# Altium project copper_suicide.PrjPCB (part 3 of 5)

## Sheet fpga-power.SchDoc: CS - FPGA - Power
size Letter; CheckedBy: J. Brinton; CompanyName: Signal Laboratories, Inc.; DrawnBy: J. Brinton; Engineer: J. Brinton; Address1: 3479 Edison Way; Address2: Menlo Park CA 94025; Address3: +1 (877) 778-8435; Address4: siglabs.com; Revision: 3; SheetNumber: 13; SheetTotal: 47
Used 17 times, as channels FPGA01/FPGAPOWER, FPGA02/FPGAPOWER, FPGA03/FPGAPOWER, FPGA30/FPGAPOWER, FPGA31/FPGAPOWER, FPGA32/FPGAPOWER, FPGA33/FPGAPOWER, FPGA10/FPGAPOWER, FPGA11/FPGAPOWER, FPGA12/FPGAPOWER, FPGA13/FPGAPOWER, FPGA20/FPGAPOWER, FPGA21/FPGAPOWER, FPGA22/FPGAPOWER, FPGA23/FPGAPOWER, CFG/FPGAPOWER, FPGA00/FPGAPOWER. Parts and nets are listed once, with the designators drawn on the sheet.
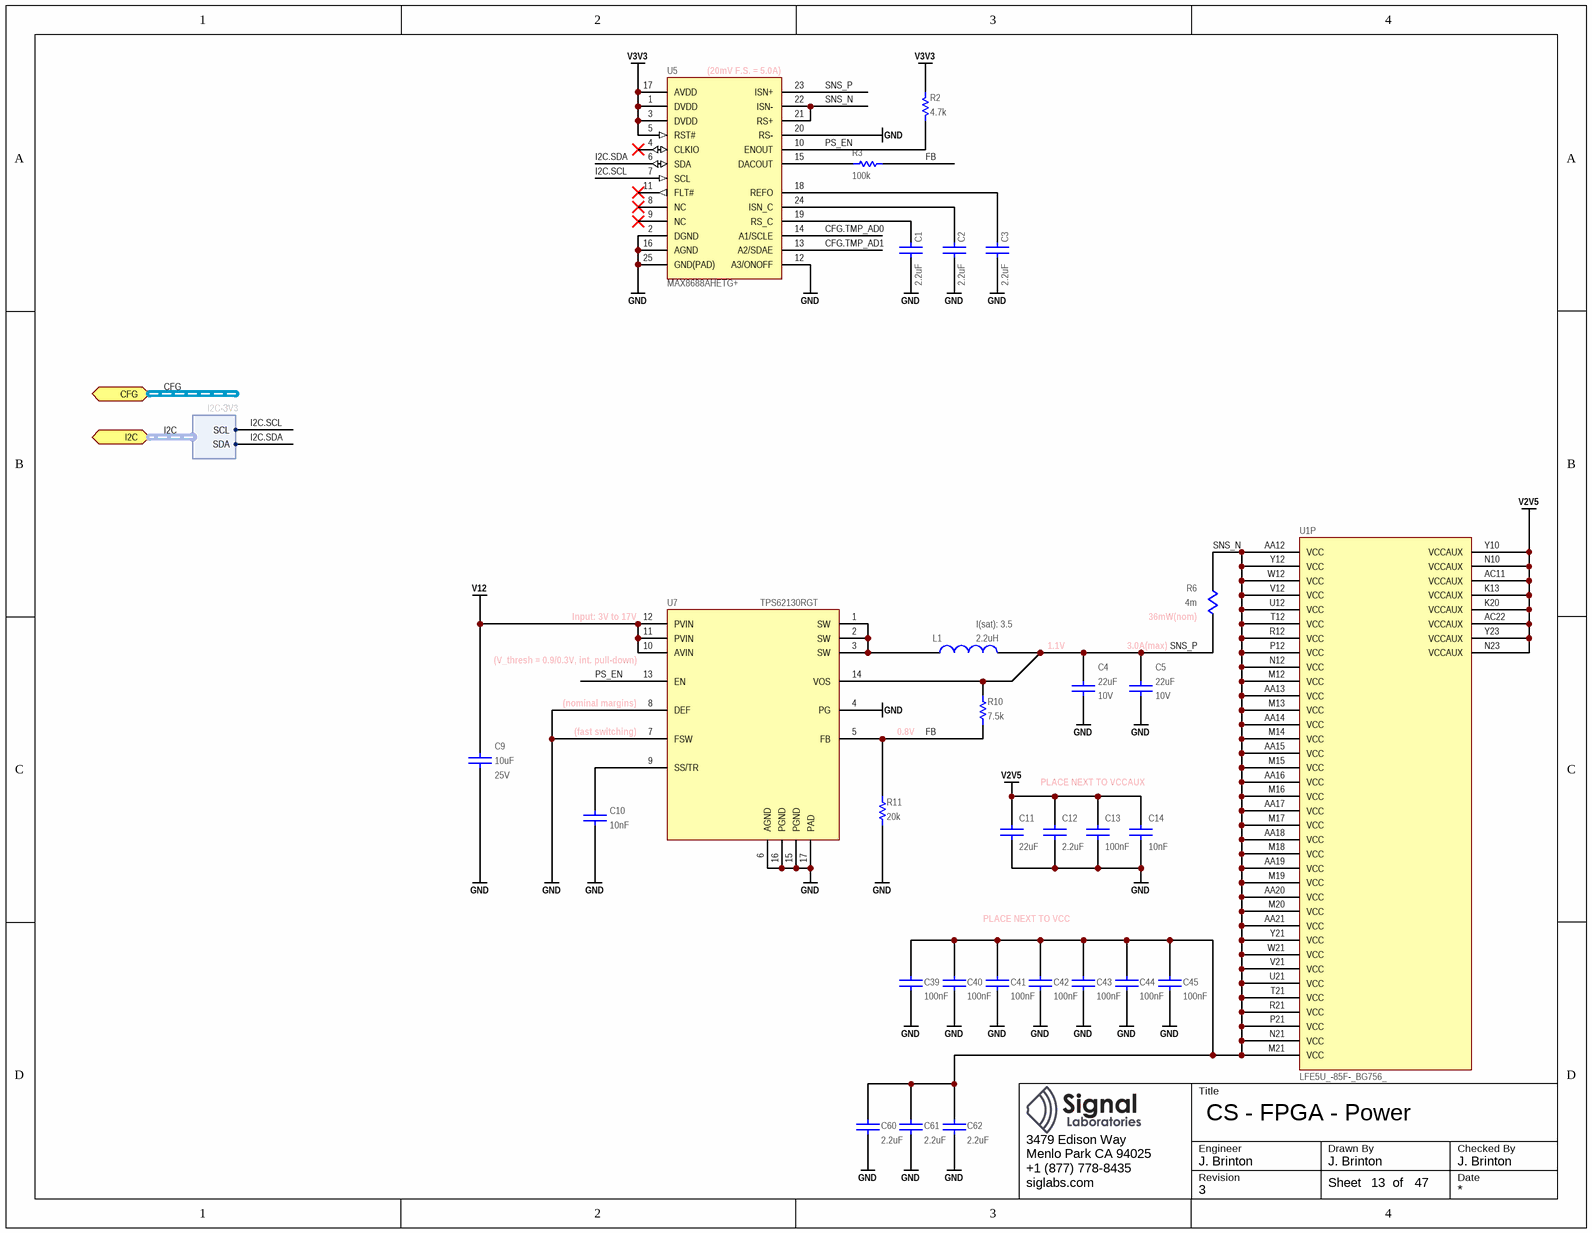
[diagram p13: fpga-power.SchDoc]

### Parts
C1  value 2.2uF  [CAPC160X80X90L20N]  (hidden comment: C1608X7R1A225M080)
C2  value 2.2uF  [CAPC160X80X90L20N]  (hidden comment: C1608X7R1A225M080)
C3  value 2.2uF  [CAPC160X80X90L20N]  (hidden comment: C1608X7R1A225M080)
C4  value 22uF  Voltage: 10V  [CAPC200X125X145L45N]  (hidden comment: C2012X7S1A226M125)
C5  value 22uF  Voltage: 10V  [CAPC200X125X145L45N]  (hidden comment: C2012X7S1A226M125)
C9  value 10uF  Voltage: 25V  [CAPC200X125X145L45N]  (hidden comment: GRM21BC81E106KE51)
C10  value 10nF  [CAPC100X50X55L25N]  (hidden comment: GRM155R71H103KA88)
C11  value 22uF  [CAPC200X125X145L45N]  (hidden comment: C2012X7S1A226M125)
C12  value 2.2uF  [CAPC160X80X90L20N]  (hidden comment: C1608X7R1A225M080)
C13  value 100nF  [CAPC100X50X55L25N]  (hidden comment: GCM155R71H104KE02)
C14  value 10nF  [CAPC100X50X55L25N]  (hidden comment: GRM155R71H103KA88)
C39  value 100nF  [CAPC100X50X55L25N]  (hidden comment: GCM155R71H104KE02)
C40  value 100nF  [CAPC100X50X55L25N]  (hidden comment: GCM155R71H104KE02)
C41  value 100nF  [CAPC100X50X55L25N]  (hidden comment: GCM155R71H104KE02)
C42  value 100nF  [CAPC100X50X55L25N]  (hidden comment: GCM155R71H104KE02)
C43  value 100nF  [CAPC100X50X55L25N]  (hidden comment: GCM155R71H104KE02)
C44  value 100nF  [CAPC100X50X55L25N]  (hidden comment: GCM155R71H104KE02)
C45  value 100nF  [CAPC100X50X55L25N]  (hidden comment: GCM155R71H104KE02)
C60  value 2.2uF  [CAPC160X80X90L20N]  (hidden comment: C1608X7R1A225M080)
C61  value 2.2uF  [CAPC160X80X90L20N]  (hidden comment: C1608X7R1A225M080)
C62  value 2.2uF  [CAPC160X80X90L20N]  (hidden comment: C1608X7R1A225M080)
L1  value 2.2uH  I(sat): 3.5  [XFL4020]  (hidden comment: XFL4020-222ME)
R2  value 4.7k  [RESC1005X40N]  (hidden comment: ERJ-2RKF4701X)
R3  value 100k  [RESC1005X40N]  (hidden comment: ERJ-2RKF1003X)
R6  value 4m  [RESC3216X80L110N]  (hidden comment: CSR1206-0R004F1)
R10  value 7.5k  [RESC2012X70N]  (hidden comment: ERA-6AEB752V)
R11  value 20k  [RESC2012X70N]  (hidden comment: ERA-6AEB203V)
U1  LFE5U_-85F-_BG756_  [caBGA756]  (part P of 19)
U5  MAX8688AHETG+  [QFN25P50_400X400X80L40X24T260N]
U7  TPS62130RGT  [S-PQFP-8N_NOVIA]

### Ports
CFG (harness CFG), I2C (harness I2C-3V3)

### Harnesses
I2C-3V3: SCL, SDA

### Nets
GND: C1.1 C2.1 C3.1 C4.1 C5.1 C9.1 C10.2 C11.1 C12.1 C13.1 C14.2 C39.1 C40.1 C41.1 C42.1 C43.1 C44.1 C45.1 C60.1 C61.1 C62.1 R11.1 U5.2(DGND) U5.12(A3/ONOFF) U5.16(AGND) U5.20(RS-) U5.25(GND(PAD)) U7.4(PG) U7.6(AGND) U7.7(FSW) U7.8(DEF) U7.15(PGND) U7.16(PGND) U7.17(PAD)
V2V5: C11.2 C12.2 C13.2 C14.1 U1.AC11(VCCAUX) U1.AC22(VCCAUX) U1.K13(VCCAUX) U1.K20(VCCAUX) U1.N10(VCCAUX) U1.N23(VCCAUX) U1.Y10(VCCAUX) U1.Y23(VCCAUX)
V3V3: R2.2 U5.1(DVDD) U5.3(DVDD) U5.5(RST#) U5.17(AVDD)
V12: C9.2 U7.10(AVIN) U7.11(PVIN) U7.12(PVIN)
CFG.TMP_AD0: U5.14(A1/SCLE)
CFG.TMP_AD1: U5.13(A2/SDAE)
FB: R3.2 R10.1 R11.2 U7.5(FB)
I2C.SCL: U5.7(SCL) ; port I2C.SCL
I2C.SDA: U5.6(SDA) ; port I2C.SDA
PS_EN: R2.1 U5.10(ENOUT) U7.13(EN)
SNS_N: C39.2 C40.2 C41.2 C42.2 C43.2 C44.2 C45.2 C60.2 C61.2 C62.2 R6.2 U1.AA12(VCC) U1.AA13(VCC) U1.AA14(VCC) U1.AA15(VCC) U1.AA16(VCC) U1.AA17(VCC) U1.AA18(VCC) U1.AA19(VCC) U1.AA20(VCC) U1.AA21(VCC) U1.M12(VCC) U1.M13(VCC) U1.M14(VCC) U1.M15(VCC) U1.M16(VCC) U1.M17(VCC) U1.M18(VCC) U1.M19(VCC) U1.M20(VCC) U1.M21(VCC) U1.N12(VCC) U1.N21(VCC) U1.P12(VCC) U1.P21(VCC) U1.R12(VCC) U1.R21(VCC) U1.T12(VCC) U1.T21(VCC) U1.U12(VCC) U1.U21(VCC) U1.V12(VCC) U1.V21(VCC) U1.W12(VCC) U1.W21(VCC) U1.Y12(VCC) U1.Y21(VCC) U5.21(RS+) U5.22(ISN-)
SNS_P: C4.2 C5.2 L1.2 R6.1 R10.2 U5.23(ISN+) U7.14(VOS)
NetC1_2: C1.2 U5.19(RS_C)
NetC2_2: C2.2 U5.24(ISN_C)
NetC3_2: C3.2 U5.18(REFO)
NetC10_1: C10.1 U7.9(SS/TR)
NetL1_1: L1.1 U7.1(SW) U7.2(SW) U7.3(SW)
NetR3_1: R3.1 U5.15(DACOUT)

Not connected (* = marked no-connect by the designer): U5 4(CLKIO)* 8(NC)* 9(NC)* 11(FLT#)*

### Channels
FPGA01/FPGAPOWER: designators C1=C1A C2=C2A C3=C3A C4=C4A C5=C5A C9=C9A C10=C10A C11=C11A C12=C12A C13=C13A C14=C14A C39=C39A C40=C40A C41=C41A C42=C42A C43=C43A C44=C44A C45=C45A C60=C60A C61=C61A C62=C62A L1=L1A R2=R2A R3=R3A R6=R6A R10=R10A R11=R11A U1=U1A#12 U5=U5A U7=U7A
FPGA02/FPGAPOWER: designators C1=C1B C2=C2B C3=C3B C4=C4B C5=C5B C9=C9B C10=C10B C11=C11B C12=C12B C13=C13B C14=C14B C39=C39B C40=C40B C41=C41B C42=C42B C43=C43B C44=C44B C45=C45B C60=C60B C61=C61B C62=C62B L1=L1B R2=R2B R3=R3B R6=R6B R10=R10B R11=R11B U1=U1B#12 U5=U5B U7=U7B
FPGA03/FPGAPOWER: designators C1=C1C C2=C2C C3=C3C C4=C4C C5=C5C C9=C9C C10=C10C C11=C11C C12=C12C C13=C13C C14=C14C C39=C39C C40=C40C C41=C41C C42=C42C C43=C43C C44=C44C C45=C45C C60=C60C C61=C61C C62=C62C L1=L1C R2=R2C R3=R3C R6=R6C R10=R10C R11=R11C U1=U1C#12 U5=U5C U7=U7C
FPGA30/FPGAPOWER: designators C1=C1D C2=C2D C3=C3D C4=C4D C5=C5D C9=C9D C10=C10D C11=C11D C12=C12D C13=C13D C14=C14D C39=C39D C40=C40D C41=C41D C42=C42D C43=C43D C44=C44D C45=C45D C60=C60D C61=C61D C62=C62D L1=L1D R2=R2D R3=R3D R6=R6D R10=R10D R11=R11D U1=U1D#12 U5=U5D U7=U7D
FPGA31/FPGAPOWER: designators C1=C1E C2=C2E C3=C3E C4=C4E C5=C5E C9=C9E C10=C10E C11=C11E C12=C12E C13=C13E C14=C14E C39=C39E C40=C40E C41=C41E C42=C42E C43=C43E C44=C44E C45=C45E C60=C60E C61=C61E C62=C62E L1=L1E R2=R2E R3=R3E R6=R6E R10=R10E R11=R11E U1=U1E#12 U5=U5E U7=U7E
FPGA32/FPGAPOWER: designators C1=C1F C2=C2F C3=C3F C4=C4F C5=C5F C9=C9F C10=C10F C11=C11F C12=C12F C13=C13F C14=C14F C39=C39F C40=C40F C41=C41F C42=C42F C43=C43F C44=C44F C45=C45F C60=C60F C61=C61F C62=C62F L1=L1F R2=R2F R3=R3F R6=R6F R10=R10F R11=R11F U1=U1F#12 U5=U5F U7=U7F
FPGA33/FPGAPOWER: designators C1=C1G C2=C2G C3=C3G C4=C4G C5=C5G C9=C9G C10=C10G C11=C11G C12=C12G C13=C13G C14=C14G C39=C39G C40=C40G C41=C41G C42=C42G C43=C43G C44=C44G C45=C45G C60=C60G C61=C61G C62=C62G L1=L1G R2=R2G R3=R3G R6=R6G R10=R10G R11=R11G U1=U1G#12 U5=U5G U7=U7G
FPGA10/FPGAPOWER: designators C1=C1H C2=C2H C3=C3H C4=C4H C5=C5H C9=C9H C10=C10H C11=C11H C12=C12H C13=C13H C14=C14H C39=C39H C40=C40H C41=C41H C42=C42H C43=C43H C44=C44H C45=C45H C60=C60H C61=C61H C62=C62H L1=L1H R2=R2H R3=R3H R6=R6H R10=R10H R11=R11H U1=U1H#12 U5=U5H U7=U7H
FPGA11/FPGAPOWER: designators C1=C1I C2=C2I C3=C3I C4=C4I C5=C5I C9=C9I C10=C10I C11=C11I C12=C12I C13=C13I C14=C14I C39=C39I C40=C40I C41=C41I C42=C42I C43=C43I C44=C44I C45=C45I C60=C60I C61=C61I C62=C62I L1=L1I R2=R2I R3=R3I R6=R6I R10=R10I R11=R11I U1=U1I#12 U5=U5I U7=U7I
FPGA12/FPGAPOWER: designators C1=C1J C2=C2J C3=C3J C4=C4J C5=C5J C9=C9J C10=C10J C11=C11J C12=C12J C13=C13J C14=C14J C39=C39J C40=C40J C41=C41J C42=C42J C43=C43J C44=C44J C45=C45J C60=C60J C61=C61J C62=C62J L1=L1J R2=R2J R3=R3J R6=R6J R10=R10J R11=R11J U1=U1J#12 U5=U5J U7=U7J
FPGA13/FPGAPOWER: designators C1=C1K C2=C2K C3=C3K C4=C4K C5=C5K C9=C9K C10=C10K C11=C11K C12=C12K C13=C13K C14=C14K C39=C39K C40=C40K C41=C41K C42=C42K C43=C43K C44=C44K C45=C45K C60=C60K C61=C61K C62=C62K L1=L1K R2=R2K R3=R3K R6=R6K R10=R10K R11=R11K U1=U1K#12 U5=U5K U7=U7K
FPGA20/FPGAPOWER: designators C1=C1L C2=C2L C3=C3L C4=C4L C5=C5L C9=C9L C10=C10L C11=C11L C12=C12L C13=C13L C14=C14L C39=C39L C40=C40L C41=C41L C42=C42L C43=C43L C44=C44L C45=C45L C60=C60L C61=C61L C62=C62L L1=L1L R2=R2L R3=R3L R6=R6L R10=R10L R11=R11L U1=U1L#12 U5=U5L U7=U7L
FPGA21/FPGAPOWER: designators C1=C1M C2=C2M C3=C3M C4=C4M C5=C5M C9=C9M C10=C10M C11=C11M C12=C12M C13=C13M C14=C14M C39=C39M C40=C40M C41=C41M C42=C42M C43=C43M C44=C44M C45=C45M C60=C60M C61=C61M C62=C62M L1=L1M R2=R2M R3=R3M R6=R6M R10=R10M R11=R11M U1=U1M#12 U5=U5M U7=U7M
FPGA22/FPGAPOWER: designators C1=C1N C2=C2N C3=C3N C4=C4N C5=C5N C9=C9N C10=C10N C11=C11N C12=C12N C13=C13N C14=C14N C39=C39N C40=C40N C41=C41N C42=C42N C43=C43N C44=C44N C45=C45N C60=C60N C61=C61N C62=C62N L1=L1N R2=R2N R3=R3N R6=R6N R10=R10N R11=R11N U1=U1N#12 U5=U5N U7=U7N
FPGA23/FPGAPOWER: designators C1=C1O C2=C2O C3=C3O C4=C4O C5=C5O C9=C9O C10=C10O C11=C11O C12=C12O C13=C13O C14=C14O C39=C39O C40=C40O C41=C41O C42=C42O C43=C43O C44=C44O C45=C45O C60=C60O C61=C61O C62=C62O L1=L1O R2=R2O R3=R3O R6=R6O R10=R10O R11=R11O U1=U1O#12 U5=U5O U7=U7O
CFG/FPGAPOWER: designators C1=C1P C2=C2P C3=C3P C4=C4P C5=C5P C9=C9P C10=C10P C11=C11P C12=C12P C13=C13P C14=C14P C39=C39P C40=C40P C41=C41P C42=C42P C43=C43P C44=C44P C45=C45P C60=C60P C61=C61P C62=C62P L1=L1P R2=R2P R3=R3P R6=R6P R10=R10P R11=R11P U1=U1P#12 U5=U5P U7=U7P
FPGA00/FPGAPOWER: designators C1=C1Q C2=C2Q C3=C3Q C4=C4Q C5=C5Q C9=C9Q C10=C10Q C11=C11Q C12=C12Q C13=C13Q C14=C14Q C39=C39Q C40=C40Q C41=C41Q C42=C42Q C43=C43Q C44=C44Q C45=C45Q C60=C60Q C61=C61Q C62=C62Q L1=L1Q R2=R2Q R3=R3Q R6=R6Q R10=R10Q R11=R11Q U1=U1Q#12 U5=U5Q U7=U7Q

### Buses and harness runs
harness CFG = port CFG
harness I2C = port I2C

### Notes on the sheet
- (near U5) (20mV F.S. = 5.0A)
- (near U7) Input: 3V to 17V
- (near U7) (V_thresh = 0.9/0.3V, int. pull-down)
- 1.1V
- (near C5) 3.0A(max)
- (near R6) 36mW(nom)
- (near U7) (fast switching)
- (near U7) (nominal margins)
- 0.8V
- PLACE NEXT TO VCCAUX
- PLACE NEXT TO VCC
- Title
- Engineer
- Revision
- Drawn By
- Checked By
- Date
- Sheet
- of

### Library data of the parts
C1-C3 C12 C60-C62 = CAP: Ceramic Capacitor 2.2uF ±20% 10V X7R 0603; Manufacturer: TDK; Tr: -55:125; Manufacturer P/N: C1608X7R1A225M080; Tolerance: ±20%; Voltage: 10V; Footprint: *; Package: 0603
C4 C5 C11 = CAP: Ceramic Capacitor 22uF ±20% 10V X7S 0805; Manufacturer: TDK; Tr: -55:125; Manufacturer P/N: C2012X7S1A226M125; Tolerance: ±20%; Package: 0805
  C11: Voltage: 10V
C9 = CAP: Ceramic Capacitor 10uF ±10% 25V X6S 0805; Manufacturer: Murata; Tr: -55:105; Manufacturer P/N: GRM21BC81E106KE51; Tolerance: ±10%; Package: 0805
C10 C14 = CAP: Ceramic Capacitor 10nF ±10% 50V X7R 0402; Manufacturer: Murata; Tr: -55:125; Manufacturer P/N: GRM155R71H103KA88; Tolerance: ±10%; Voltage: 50V; Package: 0402
C13 C39-C45 = CAP: Ceramic Capacitor 100nF ±10% 50V X7R 0402; Manufacturer: Murata; Tr: -55:125; Manufacturer P/N: GCM155R71H104KE02; Tolerance: ±10%; Voltage: 50V; Footprint: *; Package: 0402
L1 = COIL: Wirewound Inductor 2.2uH +/-20% 3.5A SMD; Manufacturer: Coilcraft; Manufacturer P/N: XFL4020-222ME
R2 = RES: Thick Film Resistor 4.7k ±1% 0.1W 75V 0402; Manufacturer: Panasonic; Tcr: ±100; Tr: -55:155; Voltage: 75; Power: 0.1; Tolerance: ±1%; Manufacturer P/N: ERJ-2RKF4701X; Alternatives: *; Footprint: *; Package: 0402
R3 = RES: Thick Film Resistor 100k ±1% 0.1W 50V 0402; Manufacturer: Panasonic; Tcr: ±100; Tr: -55:155; Voltage: 50; Power: 0.1; Manufacturer P/N: ERJ-2RKF1003X; Tolerance: ±1%; Alternatives: *; Footprint: *; Package: 0402
R6 = CSR1206-0R001F1: Current Sense Resistor 4mOhm +/-1% SMD 1206; Manufacturer: Riedon; Manufacturer P/N: CSR1206-0R004F1; Package: 1206
R10 = RES: Thin Film Resistor 7.5k ±0.1% 0.125W 100V 0805; Manufacturer: Panasonic; Tcr: ±25; Tr: -55:155; Voltage: 100; Power: 0.125; Tolerance: ±0.1%; Manufacturer P/N: ERA-6AEB752V; Alternatives: *; Footprint: *; Package: 0805
R11 = RES: Thin Film Resistor 20k ±0.1% 0.125W 100V 0805; Manufacturer: Panasonic; Tcr: ±25; Tr: -55:155; Voltage: 100; Power: 0.125; Tolerance: ±0.1%; Manufacturer P/N: ERA-6AEB203V; Alternatives: *; Footprint: *; Package: 0805
U1 = LFE5U_-85F-_BG756_: ECP5 FPGA, 85k LUT, 756-caBGA; Manufacturer: Lattice Semiconductor; Manufacturer P/N: LFE5U_-85F-_BG756_
U5 = MAX8688AHETG+: Digital Power-Supply Controller/Monitor; Manufacturer: Maxim Integrated; Manufacturer P/N: MAX8688AHETG+
U7 = TPS62130RGT: 3-17V 3A Step-Down Converter VQFN; Manufacturer: Texas Instruments; Manufacturer P/N: TPS62130RGT

## Sheet clock.SchDoc: CS - Clock Fanout
size Letter; CheckedBy: J. Brinton; CompanyName: Signal Laboratories, Inc.; DrawnBy: J. Brinton; Engineer: J. Brinton; Address1: 3479 Edison Way; Address2: Menlo Park CA 94025; Address3: +1 (877) 778-8435; Address4: siglabs.com; Revision: 3; SheetNumber: 37; SheetTotal: 47
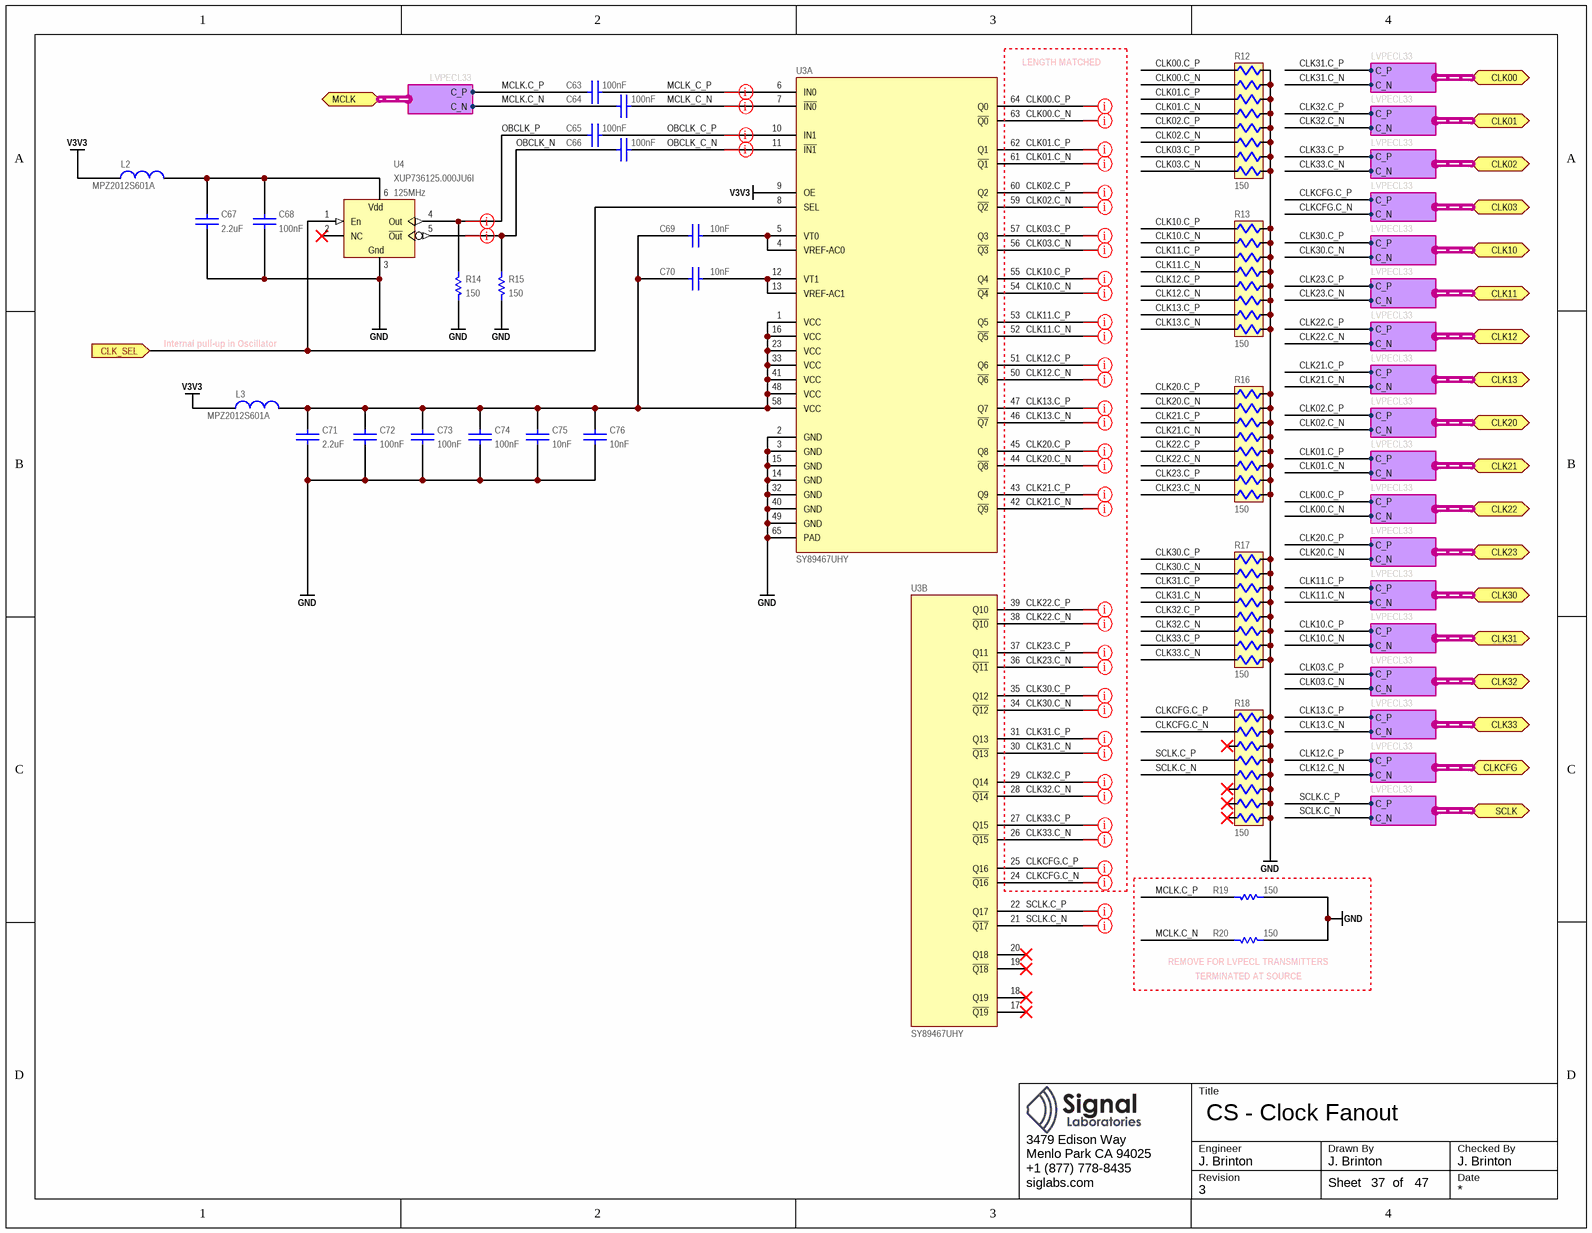
[diagram p14: clock.SchDoc]

### Parts
C63  value 100nF  [CAPC100X50X55L25N]  (hidden comment: GCM155R71H104KE02)
C64  value 100nF  [CAPC100X50X55L25N]  (hidden comment: GCM155R71H104KE02)
C65  value 100nF  [CAPC100X50X55L25N]  (hidden comment: GCM155R71H104KE02)
C66  value 100nF  [CAPC100X50X55L25N]  (hidden comment: GCM155R71H104KE02)
C67  value 2.2uF  [CAPC160X80X90L20N]  (hidden comment: C1608X7R1A225M080)
C68  value 100nF  [CAPC100X50X55L25N]  (hidden comment: GCM155R71H104KE02)
C69  value 10nF  [CAPC100X50X55L25N]  (hidden comment: GRM155R71H103KA88)
C70  value 10nF  [CAPC100X50X55L25N]  (hidden comment: GRM155R71H103KA88)
C71  value 2.2uF  [CAPC160X80X90L20N]  (hidden comment: C1608X7R1A225M080)
C72  value 100nF  [CAPC100X50X55L25N]  (hidden comment: GCM155R71H104KE02)
C73  value 100nF  [CAPC100X50X55L25N]  (hidden comment: GCM155R71H104KE02)
C74  value 100nF  [CAPC100X50X55L25N]  (hidden comment: GCM155R71H104KE02)
C75  value 10nF  [CAPC100X50X55L25N]  (hidden comment: GRM155R71H103KA88)
C76  value 10nF  [CAPC100X50X55L25N]  (hidden comment: GRM155R71H103KA88)
L2  MPZ2012S601A  [0805]
L3  MPZ2012S601A  [0805]
R12  value 150  [RESCAXE16P50_380X160X55L30X35N]  (hidden comment: EXB-2HV151JV)
R13  value 150  [RESCAXE16P50_380X160X55L30X35N]  (hidden comment: EXB-2HV151JV)
R14  value 150  [RESC1005X40N]  (hidden comment: ERJ-2RKF1500X)
R15  value 150  [RESC1005X40N]  (hidden comment: ERJ-2RKF1500X)
R16  value 150  [RESCAXE16P50_380X160X55L30X35N]  (hidden comment: EXB-2HV151JV)
R17  value 150  [RESCAXE16P50_380X160X55L30X35N]  (hidden comment: EXB-2HV151JV)
R18  value 150  [RESCAXE16P50_380X160X55L30X35N]  (hidden comment: EXB-2HV151JV)
R19  value 150  [RESC1005X40N]  (hidden comment: ERJ-2RKF1500X)
R20  value 150  [RESC1005X40N]  (hidden comment: ERJ-2RKF1500X)
U3  SY89467UHY  [QFP65P50_1200X1200X120L60X22T500N]  (parts A,B of 2)
U4  value 125MHz  [OSCSC6P254_735X505X140L110X140]  (hidden comment: XUP736125.000JU6I)

### Ports
CLK00 (harness LVPECL33), CLK01 (harness LVPECL33), CLK02 (harness LVPECL33), CLK03 (harness LVPECL33), CLK10 (harness LVPECL33), CLK11 (harness LVPECL33), CLK12 (harness LVPECL33), CLK13 (harness LVPECL33), CLK20 (harness LVPECL33), CLK21 (harness LVPECL33), CLK22 (harness LVPECL33), CLK23 (harness LVPECL33), CLK30 (harness LVPECL33), CLK31 (harness LVPECL33), CLK32 (harness LVPECL33), CLK33 (harness LVPECL33), CLK_SEL (in), CLKCFG (harness LVPECL33), MCLK (harness LVPECL33), SCLK (harness LVPECL33)

### Harnesses
LVPECL33: C_P, C_N

### Nets
GND: C67.1 C68.1 C71.1 C72.1 C73.1 C74.1 C75.2 C76.2 R12.9 R12.10 R12.11 R12.12 R12.13 R12.14 R12.15 R12.16 R13.9 R13.10 R13.11 R13.12 R13.13 R13.14 R13.15 R13.16 R14.1 R15.1 R16.9 R16.10 R16.11 R16.12 R16.13 R16.14 R16.15 R16.16 R17.9 R17.10 R17.11 R17.12 R17.13 R17.14 R17.15 R17.16 R18.9 R18.10 R18.11 R18.12 R18.13 R18.14 R18.15 R18.16 R19.2 R20.2 U3.2(GND) U3.3(GND) U3.14(GND) U3.15(GND) U3.32(GND) U3.40(GND) U3.49(GND) U3.65(PAD) U4.3(GND)
V3V3: L2.2 L3.2 U3.9(OE)
CLK00.C_N: R12.2 U3.63(~{Q0}) ; port CLK22.C_N  [project net CLK.C_N]
CLK00.C_P: R12.1 U3.64(Q0) ; port CLK22.C_P  [project net CLK.C_P]
CLK01.C_N: R12.4 U3.61(~{Q1}) ; port CLK21.C_N  [project net CLK.C_N]
CLK01.C_P: R12.3 U3.62(Q1) ; port CLK21.C_P  [project net CLK.C_P]
CLK02.C_N: R12.6 U3.59(~{Q2}) ; port CLK20.C_N  [project net CLK.C_N]
CLK02.C_P: R12.5 U3.60(Q2) ; port CLK20.C_P  [project net CLK.C_P]
CLK03.C_N: R12.8 U3.56(~{Q3}) ; port CLK32.C_N  [project net CLK.C_N]
CLK03.C_P: R12.7 U3.57(Q3) ; port CLK32.C_P  [project net CLK.C_P]
CLK10.C_N: R13.2 U3.54(~{Q4}) ; port CLK31.C_N  [project net CLK.C_N]
CLK10.C_P: R13.1 U3.55(Q4) ; port CLK31.C_P  [project net CLK.C_P]
CLK11.C_N: R13.4 U3.52(~{Q5}) ; port CLK30.C_N  [project net CLK.C_N]
CLK11.C_P: R13.3 U3.53(Q5) ; port CLK30.C_P  [project net CLK.C_P]
CLK12.C_N: R13.6 U3.50(~{Q6}) ; port CLKCFG.C_N  [project net CLK.C_N]
CLK12.C_P: R13.5 U3.51(Q6) ; port CLKCFG.C_P  [project net CLK.C_P]
CLK13.C_N: R13.8 U3.46(~{Q7}) ; port CLK33.C_N  [project net CLK.C_N]
CLK13.C_P: R13.7 U3.47(Q7) ; port CLK33.C_P  [project net CLK.C_P]
CLK20.C_N: R16.2 U3.44(~{Q8}) ; port CLK23.C_N  [project net CLK.C_N]
CLK20.C_P: R16.1 U3.45(Q8) ; port CLK23.C_P  [project net CLK.C_P]
CLK21.C_N: R16.4 U3.42(~{Q9}) ; port CLK13.C_N  [project net CLK.C_N]
CLK21.C_P: R16.3 U3.43(Q9) ; port CLK13.C_P  [project net CLK.C_P]
CLK22.C_N: R16.6 U3.38(~{Q10}) ; port CLK12.C_N  [project net CLK.C_N]
CLK22.C_P: R16.5 U3.39(Q10) ; port CLK12.C_P  [project net CLK.C_P]
CLK23.C_N: R16.8 U3.36(~{Q11}) ; port CLK11.C_N  [project net CLK.C_N]
CLK23.C_P: R16.7 U3.37(Q11) ; port CLK11.C_P  [project net CLK.C_P]
CLK30.C_N: R17.2 U3.34(~{Q12}) ; port CLK10.C_N  [project net CLK.C_N]
CLK30.C_P: R17.1 U3.35(Q12) ; port CLK10.C_P  [project net CLK.C_P]
CLK31.C_N: R17.4 U3.30(~{Q13}) ; port CLK00.C_N  [project net CLK.C_N]
CLK31.C_P: R17.3 U3.31(Q13) ; port CLK00.C_P  [project net CLK.C_P]
CLK32.C_N: R17.6 U3.28(~{Q14}) ; port CLK01.C_N  [project net CLK.C_N]
CLK32.C_P: R17.5 U3.29(Q14) ; port CLK01.C_P  [project net CLK.C_P]
CLK33.C_N: R17.8 U3.26(~{Q15}) ; port CLK02.C_N  [project net CLK.C_N]
CLK33.C_P: R17.7 U3.27(Q15) ; port CLK02.C_P  [project net CLK.C_P]
CLK_SEL: U3.8(SEL) U4.1(En) ; port CLK_SEL
CLKCFG.C_N: R18.2 U3.24(~{Q16}) ; port CLK03.C_N  [project net CLK.C_N]
CLKCFG.C_P: R18.1 U3.25(Q16) ; port CLK03.C_P  [project net CLK.C_P]
MCLK.C_N: C64.2 R20.1 ; port MCLK.C_N
MCLK.C_P: C63.2 R19.1 ; port MCLK.C_P
MCLK_C_N: C64.1 U3.7(~{IN0})
MCLK_C_P: C63.1 U3.6(IN0)
OBCLK_C_N: C66.1 U3.11(~{IN1})
OBCLK_C_P: C65.1 U3.10(IN1)
OBCLK_N: C66.2 R15.2 U4.5(~{Out})
OBCLK_P: C65.2 R14.2 U4.4(Out)
SCLK.C_N: R18.5 U3.21(~{Q17}) ; port SCLK.C_N
SCLK.C_P: R18.4 U3.22(Q17) ; port SCLK.C_P
NetC67_2: C67.2 C68.2 L2.1 U4.6(Vdd)
NetC69_1: C69.1 C70.1 C71.2 C72.2 C73.2 C74.2 C75.1 C76.1 L3.1 U3.1(VCC) U3.16(VCC) U3.23(VCC) U3.33(VCC) U3.41(VCC) U3.48(VCC) U3.58(VCC)
NetC69_2: C69.2 U3.4(VREF-AC0) U3.5(VT0)
NetC70_2: C70.2 U3.12(VT1) U3.13(VREF-AC1)

Not connected (* = marked no-connect by the designer): R18 3* 6* 7* 8*; U3 17(~{Q19})* 18(Q19)* 19(~{Q18})* 20(Q18)*; U4 2(NC)*

### Layout directives
net class z50; differential pair; net class tight; net class clks: CLK.C_N, CLK.C_P, MCLK_C_N, MCLK_C_P, OBCLK_C_N, OBCLK_C_P, OBCLK_N, OBCLK_P, SCLK.C_N, SCLK.C_P

### Notes on the sheet
- (near U3) LENGTH MATCHED
- Internal pull-up in Oscillator
- (near R20) REMOVE FOR LVPECL TRANSMITTERS
- (near R20) TERMINATED AT SOURCE
- Title
- Engineer
- Revision
- Drawn By
- Checked By
- Date
- Sheet
- of
- (in symbol EG-2121CA 100.0000M-PHPAB) Gnd

### Library data of the parts
C63-C66 C68 C72-C74 = CAP: as C13 on sheet fpga-power; Manufacturer P/N: GCM155R71H104KE02; Tolerance: ±10%; Voltage: 50V; Footprint: *; Package: 0402
C67 C71 = CAP: as C1-C3 on sheet fpga-power; Manufacturer P/N: C1608X7R1A225M080; Tolerance: ±20%; Voltage: 10V; Footprint: *; Package: 0603
C69 C70 C75 C76 = CAP: as C10 on sheet fpga-power; Manufacturer P/N: GRM155R71H103KA88; Tolerance: ±10%; Voltage: 50V; Package: 0402
L2 L3 = INDUCTANCE1: Ferrite Bead 600-Ohm @ 100 MHz 2A 0805; Manufacturer: TDK; Manufacturer P/N: MPZ2012S601A
R12 R13 R16-R18 = EXB-2HV470JV: 8 Resistor Array 150 ±5% 0.0625W 25V 1506; Manufacturer: Panasonic; Tr: -55:125; Manufacturer P/N: EXB-2HV151JV; Package: 1506; Tolerance: ±5%
R14 R15 R19 R20 = RES: Thick Film Resistor 150 ±1% 0.1W 50V 0402; Manufacturer: Panasonic; Tcr: ±100; Tr: -55:155; Voltage: 50; Power: 0.1; Tolerance: ±1%; Manufacturer P/N: ERJ-2RKF1500X; Alternatives: *; Footprint: *; Package: 0402
  R19 R20: Do Not Place: *
U3 = SY89467UHY: 2:20 LVPECL Clock Distribution Driver; Manufacturer: Microchip; Manufacturer P/N: SY89467UHY
U4 = EG-2121CA 100.0000M-PHPAB: Oscillator 100MHz LPECL 3.3V 25ppm SMD; Manufacturer: IDT; Manufacturer P/N: XUP736125.000JU6I

## Sheet con-right-bot.SchDoc: CS - Right Bottom
size Letter; CheckedBy: J. Brinton; CompanyName: Signal Laboratories, Inc.; DrawnBy: J. Brinton; Engineer: J. Brinton; Address1: 3479 Edison Way; Address2: Menlo Park CA 94025; Address3: +1 (877) 778-8435; Address4: siglabs.com; Revision: 3; SheetNumber: 36; SheetTotal: 47
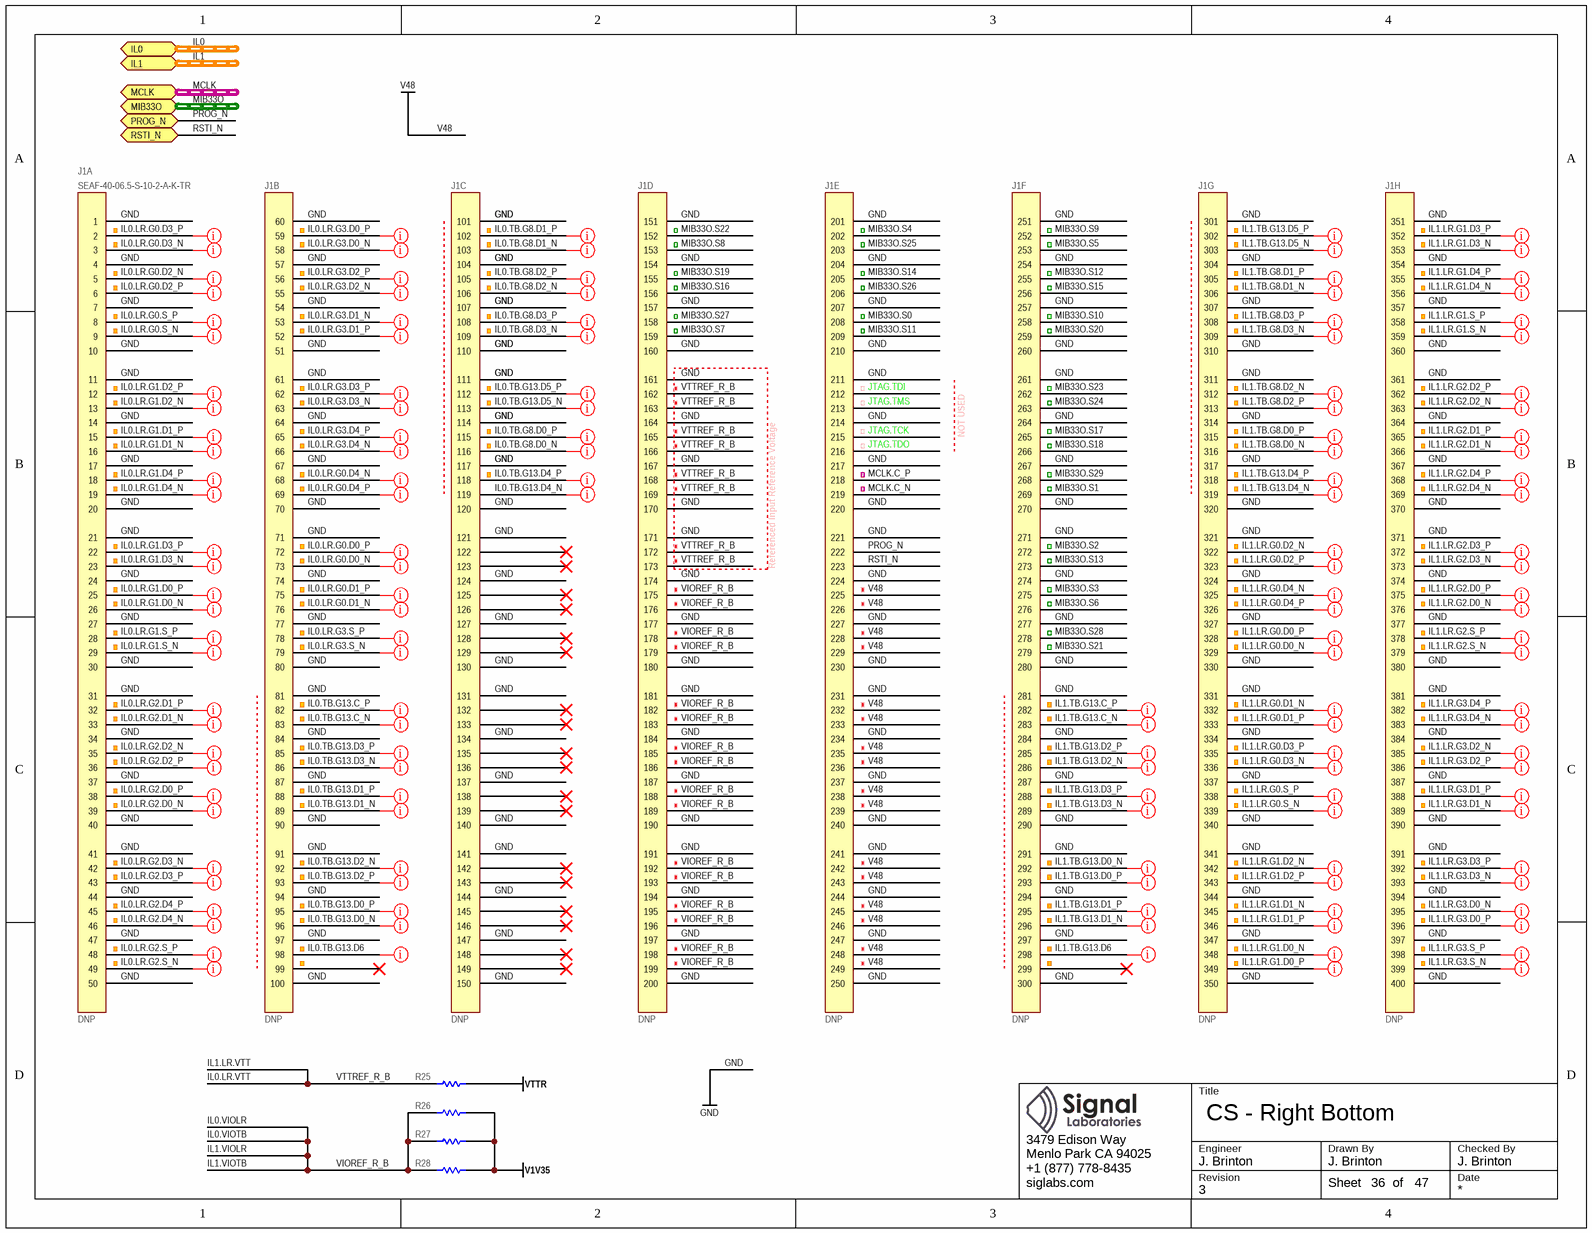
[diagram p15: con-right-bot.SchDoc]

### Parts
J1  SEAF-40-06.5-S-10-2-A-K-TR  Do Not Place: DNP  [SEAF-40-06.5-S-10-2-A-K-TR]  (parts A,B,C,D,E,F,G,H of 8)
R25  SOLDER_LINK  [SOLDERLINK0603X26N]  (value not drawn)  (no BOM)
R26  SOLDER_LINK  [SOLDERLINK0603X26N]  (value not drawn)  (no BOM)
R27  SOLDER_LINK  [SOLDERLINK0603X26N]  (value not drawn)  (no BOM)
R28  SOLDER_LINK  [SOLDERLINK0603X26N]  (value not drawn)  (no BOM)

### Ports
IL0 (harness IL), IL1 (harness IL), MCLK (harness LVPECL33), MIB33O (harness MIB), PROG_N (bidir), RSTI_N (bidir)

### Nets
GND: J1.1 J1.4 J1.7 J1.10 J1.11 J1.14 J1.17 J1.20 J1.21 J1.24 J1.27 J1.30 J1.31 J1.34 J1.37 J1.40 J1.41 J1.44 J1.47 J1.50 J1.51 J1.54 J1.57 J1.60 J1.61 J1.64 J1.67 J1.70 J1.71 J1.74 J1.77 J1.80 J1.81 J1.84 J1.87 J1.90 J1.91 J1.94 J1.97 J1.100 J1.101 J1.104 J1.107 J1.110 J1.111 J1.114 J1.117 J1.120 J1.121 J1.124 J1.127 J1.130 J1.131 J1.134 J1.137 J1.140 J1.141 J1.144 J1.147 J1.150 J1.151 J1.154 J1.157 J1.160 J1.161 J1.164 J1.167 J1.170 J1.171 J1.174 J1.177 J1.180 J1.181 J1.184 J1.187 J1.190 J1.191 J1.194 J1.197 J1.200 J1.201 J1.204 J1.207 J1.210 J1.211 J1.214 J1.217 J1.220 J1.221 J1.224 J1.227 J1.230 J1.231 J1.234 J1.237 J1.240 J1.241 J1.244 J1.247 J1.250 J1.251 J1.254 J1.257 J1.260 J1.261 J1.264 J1.267 J1.270 J1.271 J1.274 J1.277 J1.280 J1.281 J1.284 J1.287 J1.290 J1.291 J1.294 J1.297 J1.300 J1.301 J1.304 J1.307 J1.310 J1.311 J1.314 J1.317 J1.320 J1.321 J1.324 J1.327 J1.330 J1.331 J1.334 J1.337 J1.340 J1.341 J1.344 J1.347 J1.350 J1.351 J1.354 J1.357 J1.360 J1.361 J1.364 J1.367 J1.370 J1.371 J1.374 J1.377 J1.380 J1.381 J1.384 J1.387 J1.390 J1.391 J1.394 J1.397 J1.400
V1V35: R26.1 R27.1 R28.1
V48: J1.225 J1.226 J1.228 J1.229 J1.232 J1.233 J1.235 J1.236 J1.238 J1.239 J1.242 J1.243 J1.245 J1.246 J1.248 J1.249
VTTR: R25.1
IL0.LR.G0.D0_N: J1.73
IL0.LR.G0.D0_P: J1.72
IL0.LR.G0.D1_N: J1.76
IL0.LR.G0.D1_P: J1.75
IL0.LR.G0.D2_N: J1.5
IL0.LR.G0.D2_P: J1.6
IL0.LR.G0.D3_N: J1.3
IL0.LR.G0.D3_P: J1.2
IL0.LR.G0.D4_N: J1.68
IL0.LR.G0.D4_P: J1.69
IL0.LR.G0.S_N: J1.9
IL0.LR.G0.S_P: J1.8
IL0.LR.G1.D0_N: J1.26
IL0.LR.G1.D0_P: J1.25
IL0.LR.G1.D1_N: J1.16
IL0.LR.G1.D1_P: J1.15
IL0.LR.G1.D2_N: J1.13
IL0.LR.G1.D2_P: J1.12
IL0.LR.G1.D3_N: J1.23
IL0.LR.G1.D3_P: J1.22
IL0.LR.G1.D4_N: J1.19
IL0.LR.G1.D4_P: J1.18
IL0.LR.G1.S_N: J1.29
IL0.LR.G1.S_P: J1.28
IL0.LR.G2.D0_N: J1.39
IL0.LR.G2.D0_P: J1.38
IL0.LR.G2.D1_N: J1.33
IL0.LR.G2.D1_P: J1.32
IL0.LR.G2.D2_N: J1.35
IL0.LR.G2.D2_P: J1.36
IL0.LR.G2.D3_N: J1.42
IL0.LR.G2.D3_P: J1.43
IL0.LR.G2.D4_N: J1.46
IL0.LR.G2.D4_P: J1.45
IL0.LR.G2.S_N: J1.49
IL0.LR.G2.S_P: J1.48
IL0.LR.G3.D0_N: J1.58
IL0.LR.G3.D0_P: J1.59
IL0.LR.G3.D1_N: J1.53
IL0.LR.G3.D1_P: J1.52
IL0.LR.G3.D2_N: J1.55
IL0.LR.G3.D2_P: J1.56
IL0.LR.G3.D3_N: J1.63
IL0.LR.G3.D3_P: J1.62
IL0.LR.G3.D4_N: J1.66
IL0.LR.G3.D4_P: J1.65
IL0.LR.G3.S_N: J1.79
IL0.LR.G3.S_P: J1.78
IL0.LR.VTT: J1.162 J1.163 J1.165 J1.166 J1.168 J1.169 J1.172 J1.173 R25.2  [also labelled IL1.LR.VTT, VTTREF_R_B]
IL0.TB.G8.D0_N: J1.116
IL0.TB.G8.D0_P: J1.115
IL0.TB.G8.D1_N: J1.103
IL0.TB.G8.D1_P: J1.102
IL0.TB.G8.D2_N: J1.106
IL0.TB.G8.D2_P: J1.105
IL0.TB.G8.D3_N: J1.109
IL0.TB.G8.D3_P: J1.108
IL0.TB.G13.C_N: J1.83
IL0.TB.G13.C_P: J1.82
IL0.TB.G13.D0_N: J1.96
IL0.TB.G13.D0_P: J1.95
IL0.TB.G13.D1_N: J1.89
IL0.TB.G13.D1_P: J1.88
IL0.TB.G13.D2_N: J1.92
IL0.TB.G13.D2_P: J1.93
IL0.TB.G13.D3_N: J1.86
IL0.TB.G13.D3_P: J1.85
IL0.TB.G13.D4_N: J1.119
IL0.TB.G13.D4_P: J1.118
IL0.TB.G13.D5_N: J1.113
IL0.TB.G13.D5_P: J1.112
IL0.TB.G13.D6: J1.98
IL0.VIOLR: J1.175 J1.176 J1.178 J1.179 J1.182 J1.183 J1.185 J1.186 J1.188 J1.189 J1.192 J1.193 J1.195 J1.196 J1.198 J1.199 R26.2 R27.2 R28.2  [also labelled IL0.VIOTB, IL1.VIOLR, IL1.VIOTB, VIOREF_R_B]
IL1.LR.G0.D0_N: J1.329
IL1.LR.G0.D0_P: J1.328
IL1.LR.G0.D1_N: J1.332
IL1.LR.G0.D1_P: J1.333
IL1.LR.G0.D2_N: J1.322
IL1.LR.G0.D2_P: J1.323
IL1.LR.G0.D3_N: J1.336
IL1.LR.G0.D3_P: J1.335
IL1.LR.G0.D4_N: J1.325
IL1.LR.G0.D4_P: J1.326
IL1.LR.G0.S_N: J1.339
IL1.LR.G0.S_P: J1.338
IL1.LR.G1.D0_N: J1.348
IL1.LR.G1.D0_P: J1.349
IL1.LR.G1.D1_N: J1.345
IL1.LR.G1.D1_P: J1.346
IL1.LR.G1.D2_N: J1.342
IL1.LR.G1.D2_P: J1.343
IL1.LR.G1.D3_N: J1.353
IL1.LR.G1.D3_P: J1.352
IL1.LR.G1.D4_N: J1.356
IL1.LR.G1.D4_P: J1.355
IL1.LR.G1.S_N: J1.359
IL1.LR.G1.S_P: J1.358
IL1.LR.G2.D0_N: J1.376
IL1.LR.G2.D0_P: J1.375
IL1.LR.G2.D1_N: J1.366
IL1.LR.G2.D1_P: J1.365
IL1.LR.G2.D2_N: J1.363
IL1.LR.G2.D2_P: J1.362
IL1.LR.G2.D3_N: J1.373
IL1.LR.G2.D3_P: J1.372
IL1.LR.G2.D4_N: J1.369
IL1.LR.G2.D4_P: J1.368
IL1.LR.G2.S_N: J1.379
IL1.LR.G2.S_P: J1.378
IL1.LR.G3.D0_N: J1.395
IL1.LR.G3.D0_P: J1.396
IL1.LR.G3.D1_N: J1.389
IL1.LR.G3.D1_P: J1.388
IL1.LR.G3.D2_N: J1.385
IL1.LR.G3.D2_P: J1.386
IL1.LR.G3.D3_N: J1.393
IL1.LR.G3.D3_P: J1.392
IL1.LR.G3.D4_N: J1.383
IL1.LR.G3.D4_P: J1.382
IL1.LR.G3.S_N: J1.399
IL1.LR.G3.S_P: J1.398
IL1.TB.G8.D0_N: J1.316
IL1.TB.G8.D0_P: J1.315
IL1.TB.G8.D1_N: J1.306
IL1.TB.G8.D1_P: J1.305
IL1.TB.G8.D2_N: J1.312
IL1.TB.G8.D2_P: J1.313
IL1.TB.G8.D3_N: J1.309
IL1.TB.G8.D3_P: J1.308
IL1.TB.G13.C_N: J1.283
IL1.TB.G13.C_P: J1.282
IL1.TB.G13.D0_N: J1.292
IL1.TB.G13.D0_P: J1.293
IL1.TB.G13.D1_N: J1.296
IL1.TB.G13.D1_P: J1.295
IL1.TB.G13.D2_N: J1.286
IL1.TB.G13.D2_P: J1.285
IL1.TB.G13.D3_N: J1.289
IL1.TB.G13.D3_P: J1.288
IL1.TB.G13.D4_N: J1.319
IL1.TB.G13.D4_P: J1.318
IL1.TB.G13.D5_N: J1.303
IL1.TB.G13.D5_P: J1.302
IL1.TB.G13.D6: J1.298
MCLK.C_N: J1.219
MCLK.C_P: J1.218
MIB33O.S0: J1.208
MIB33O.S1: J1.269
MIB33O.S2: J1.272
MIB33O.S3: J1.275
MIB33O.S4: J1.202
MIB33O.S5: J1.253
MIB33O.S6: J1.276
MIB33O.S7: J1.159
MIB33O.S8: J1.153
MIB33O.S9: J1.252
MIB33O.S10: J1.258
MIB33O.S11: J1.209
MIB33O.S12: J1.255
MIB33O.S13: J1.273
MIB33O.S14: J1.205
MIB33O.S15: J1.256
MIB33O.S16: J1.156
MIB33O.S17: J1.265
MIB33O.S18: J1.266
MIB33O.S19: J1.155
MIB33O.S20: J1.259
MIB33O.S21: J1.279
MIB33O.S22: J1.152
MIB33O.S23: J1.262
MIB33O.S24: J1.263
MIB33O.S25: J1.203
MIB33O.S26: J1.206
MIB33O.S27: J1.158
MIB33O.S28: J1.278
MIB33O.S29: J1.268
PROG_N: J1.222 ; port PROG_N
RSTI_N: J1.223 ; port RSTI_N

Not connected (* = marked no-connect by the designer): J1 99* 122* 123* 125* 126* 128* 129* 132* 133* 135* 136* 138* 139* 142* 143* 145* 146* 148* 149* 212 213 215 216 299*

### Buses and harness runs
harness IL0 = port IL0
harness IL1 = port IL1
harness MCLK = port MCLK
harness MIB33O = port MIB33O

### Layout directives
net class z50; differential pair; net class loose: IL0.LR.G0.D0_N, IL0.LR.G0.D0_P, IL0.LR.G0.D1_N, IL0.LR.G0.D1_P, IL0.LR.G0.D2_N, IL0.LR.G0.D2_P, IL0.LR.G0.D3_N, IL0.LR.G0.D3_P, IL0.LR.G0.D4_N, IL0.LR.G0.D4_P, IL0.LR.G0.S_N, IL0.LR.G0.S_P, IL0.LR.G1.D0_N, IL0.LR.G1.D0_P, IL0.LR.G1.D1_N, IL0.LR.G1.D1_P, IL0.LR.G1.D2_N, IL0.LR.G1.D2_P, IL0.LR.G1.D3_N, IL0.LR.G1.D3_P, IL0.LR.G1.D4_N, IL0.LR.G1.D4_P, IL0.LR.G1.S_N, IL0.LR.G1.S_P, IL0.LR.G2.D0_N, IL0.LR.G2.D0_P, IL0.LR.G2.D1_N, IL0.LR.G2.D1_P, IL0.LR.G2.D2_N, IL0.LR.G2.D2_P, IL0.LR.G2.D3_N, IL0.LR.G2.D3_P, IL0.LR.G2.D4_N, IL0.LR.G2.D4_P, IL0.LR.G2.S_N, IL0.LR.G2.S_P, IL0.LR.G3.D0_N, IL0.LR.G3.D0_P, IL0.LR.G3.D1_N, IL0.LR.G3.D1_P, IL0.LR.G3.D2_N, IL0.LR.G3.D2_P, IL0.LR.G3.D3_N, IL0.LR.G3.D3_P, IL0.LR.G3.D4_N, IL0.LR.G3.D4_P, IL0.LR.G3.S_N, IL0.LR.G3.S_P, IL0.TB.G8.D0_N, IL0.TB.G8.D0_P, IL0.TB.G8.D1_N, IL0.TB.G8.D1_P, IL0.TB.G8.D2_N, IL0.TB.G8.D2_P, IL0.TB.G8.D3_N, IL0.TB.G8.D3_P, IL0.TB.G13.C_N, IL0.TB.G13.C_P, IL0.TB.G13.D0_N, IL0.TB.G13.D0_P, IL0.TB.G13.D1_N, IL0.TB.G13.D1_P, IL0.TB.G13.D2_N, IL0.TB.G13.D2_P, IL0.TB.G13.D3_N, IL0.TB.G13.D3_P, IL0.TB.G13.D4_N, IL0.TB.G13.D4_P, IL0.TB.G13.D5_N, IL0.TB.G13.D5_P, IL1.LR.G0.D0_N, IL1.LR.G0.D0_P, IL1.LR.G0.D1_N, IL1.LR.G0.D1_P, IL1.LR.G0.D2_N, IL1.LR.G0.D2_P, IL1.LR.G0.D3_N, IL1.LR.G0.D3_P, IL1.LR.G0.D4_N, IL1.LR.G0.D4_P, IL1.LR.G0.S_N, IL1.LR.G0.S_P, IL1.LR.G1.D0_N, IL1.LR.G1.D0_P, IL1.LR.G1.D1_N, IL1.LR.G1.D1_P, IL1.LR.G1.D2_N, IL1.LR.G1.D2_P, IL1.LR.G1.D3_N, IL1.LR.G1.D3_P, IL1.LR.G1.D4_N, IL1.LR.G1.D4_P, IL1.LR.G1.S_N, IL1.LR.G1.S_P, IL1.LR.G2.D0_N, IL1.LR.G2.D0_P, IL1.LR.G2.D1_N, IL1.LR.G2.D1_P, IL1.LR.G2.D2_N, IL1.LR.G2.D2_P, IL1.LR.G2.D3_N, IL1.LR.G2.D3_P, IL1.LR.G2.D4_N, IL1.LR.G2.D4_P, IL1.LR.G2.S_N, IL1.LR.G2.S_P, IL1.LR.G3.D0_N, IL1.LR.G3.D0_P, IL1.LR.G3.D1_N, IL1.LR.G3.D1_P, IL1.LR.G3.D2_N, IL1.LR.G3.D2_P, IL1.LR.G3.D3_N, IL1.LR.G3.D3_P, IL1.LR.G3.D4_N, IL1.LR.G3.D4_P, IL1.LR.G3.S_N, IL1.LR.G3.S_P, IL1.TB.G8.D0_N, IL1.TB.G8.D0_P, IL1.TB.G8.D1_N, IL1.TB.G8.D1_P, IL1.TB.G8.D2_N, IL1.TB.G8.D2_P, IL1.TB.G8.D3_N, IL1.TB.G8.D3_P, IL1.TB.G13.C_N, IL1.TB.G13.C_P, IL1.TB.G13.D0_N, IL1.TB.G13.D0_P, IL1.TB.G13.D1_N, IL1.TB.G13.D1_P, IL1.TB.G13.D2_N, IL1.TB.G13.D2_P, IL1.TB.G13.D3_N, IL1.TB.G13.D3_P, IL1.TB.G13.D4_N, IL1.TB.G13.D4_P, IL1.TB.G13.D5_N, IL1.TB.G13.D5_P
net class z50: IL0.TB.G13.D6, IL1.TB.G13.D6

### Notes on the sheet
- (near J1) JTAG.TDI
- (near J1) JTAG.TCK
- (near J1) JTAG.TDO
- (near J1) JTAG.TMS
- NOT USED
- Referenced Input Reference Voltage
- Title
- Engineer
- Revision
- Drawn By
- Checked By
- Date
- Sheet
- of

### Library data of the parts
J1 = SEAF-40-06.5-S-10-2-A-K-TR: Terminal Array Assembly, Surface Mount, 0.050" Pitch, 400 Pins; Manufacturer: Samtec; Manufacturer P/N: SEAF-40-06.5-S-10-2-A-K-TR
R25-R28 = RES: Solder Link; Manufacturer P/N: *; Manufacturer: *

## Sheet con-left-bot.SchDoc: CS - Left Bottom
size Letter; CheckedBy: J. Brinton; CompanyName: Signal Laboratories, Inc.; DrawnBy: J. Brinton; Engineer: J. Brinton; Address1: 3479 Edison Way; Address2: Menlo Park CA 94025; Address3: +1 (877) 778-8435; Address4: siglabs.com; Revision: 3; SheetNumber: 35; SheetTotal: 47
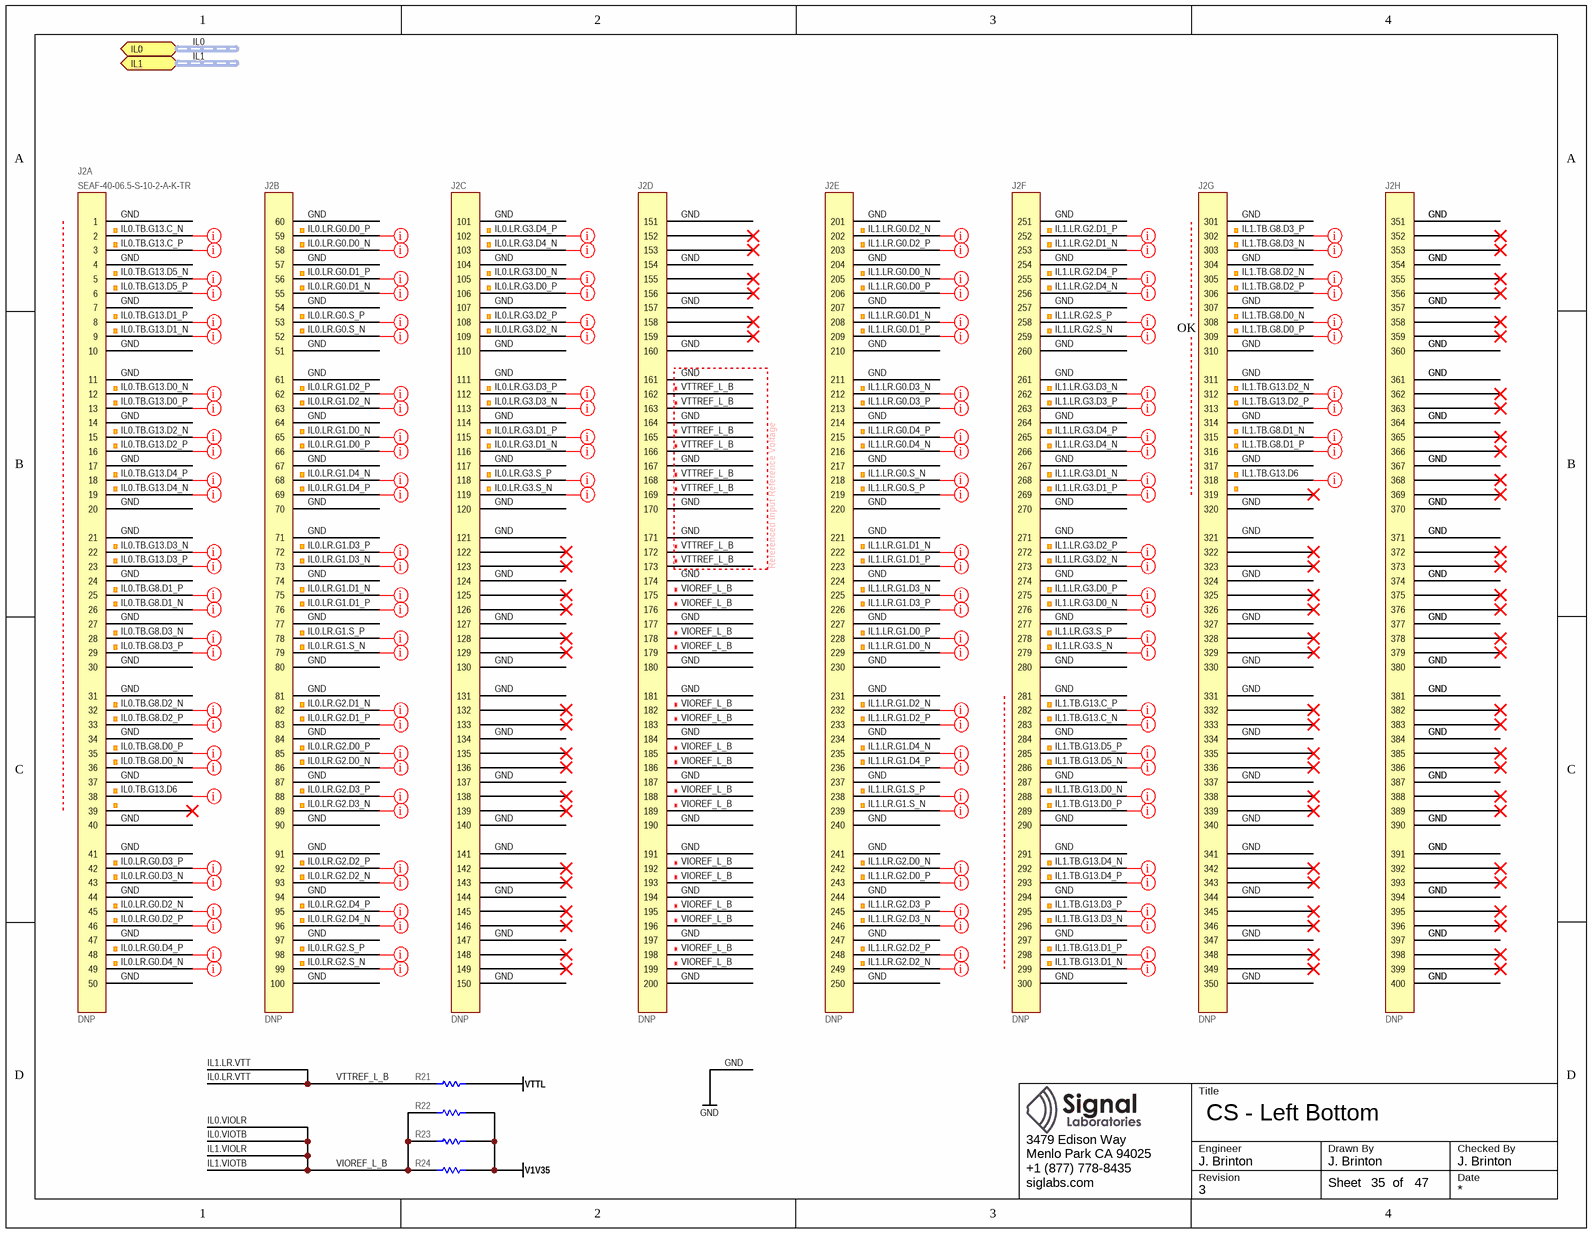
[diagram p16: con-left-bot.SchDoc]

### Parts
J2  SEAF-40-06.5-S-10-2-A-K-TR  Do Not Place: DNP  [SEAF-40-06.5-S-10-2-A-K-TR]  (parts A,B,C,D,E,F,G,H of 8)
R21  SOLDER_LINK  [SOLDERLINK0603X26N]  (value not drawn)  (no BOM)
R22  SOLDER_LINK  [SOLDERLINK0603X26N]  (value not drawn)  (no BOM)
R23  SOLDER_LINK  [SOLDERLINK0603X26N]  (value not drawn)  (no BOM)
R24  SOLDER_LINK  [SOLDERLINK0603X26N]  (value not drawn)  (no BOM)

### Ports
IL0 (harness IL), IL1 (harness IL)

### Nets
GND: J2.1 J2.4 J2.7 J2.10 J2.11 J2.14 J2.17 J2.20 J2.21 J2.24 J2.27 J2.30 J2.31 J2.34 J2.37 J2.40 J2.41 J2.44 J2.47 J2.50 J2.51 J2.54 J2.57 J2.60 J2.61 J2.64 J2.67 J2.70 J2.71 J2.74 J2.77 J2.80 J2.81 J2.84 J2.87 J2.90 J2.91 J2.94 J2.97 J2.100 J2.101 J2.104 J2.107 J2.110 J2.111 J2.114 J2.117 J2.120 J2.121 J2.124 J2.127 J2.130 J2.131 J2.134 J2.137 J2.140 J2.141 J2.144 J2.147 J2.150 J2.151 J2.154 J2.157 J2.160 J2.161 J2.164 J2.167 J2.170 J2.171 J2.174 J2.177 J2.180 J2.181 J2.184 J2.187 J2.190 J2.191 J2.194 J2.197 J2.200 J2.201 J2.204 J2.207 J2.210 J2.211 J2.214 J2.217 J2.220 J2.221 J2.224 J2.227 J2.230 J2.231 J2.234 J2.237 J2.240 J2.241 J2.244 J2.247 J2.250 J2.251 J2.254 J2.257 J2.260 J2.261 J2.264 J2.267 J2.270 J2.271 J2.274 J2.277 J2.280 J2.281 J2.284 J2.287 J2.290 J2.291 J2.294 J2.297 J2.300 J2.301 J2.304 J2.307 J2.310 J2.311 J2.314 J2.317 J2.320 J2.321 J2.324 J2.327 J2.330 J2.331 J2.334 J2.337 J2.340 J2.341 J2.344 J2.347 J2.350 J2.351 J2.354 J2.357 J2.360 J2.361 J2.364 J2.367 J2.370 J2.371 J2.374 J2.377 J2.380 J2.381 J2.384 J2.387 J2.390 J2.391 J2.394 J2.397 J2.400
V1V35: R22.1 R23.1 R24.1
VTTL: R21.1
IL0.LR.G0.D0_N: J2.58
IL0.LR.G0.D0_P: J2.59
IL0.LR.G0.D1_N: J2.55
IL0.LR.G0.D1_P: J2.56
IL0.LR.G0.D2_N: J2.45
IL0.LR.G0.D2_P: J2.46
IL0.LR.G0.D3_N: J2.43
IL0.LR.G0.D3_P: J2.42
IL0.LR.G0.D4_N: J2.49
IL0.LR.G0.D4_P: J2.48
IL0.LR.G0.S_N: J2.52
IL0.LR.G0.S_P: J2.53
IL0.LR.G1.D0_N: J2.65
IL0.LR.G1.D0_P: J2.66
IL0.LR.G1.D1_N: J2.75
IL0.LR.G1.D1_P: J2.76
IL0.LR.G1.D2_N: J2.63
IL0.LR.G1.D2_P: J2.62
IL0.LR.G1.D3_N: J2.73
IL0.LR.G1.D3_P: J2.72
IL0.LR.G1.D4_N: J2.68
IL0.LR.G1.D4_P: J2.69
IL0.LR.G1.S_N: J2.79
IL0.LR.G1.S_P: J2.78
IL0.LR.G2.D0_N: J2.86
IL0.LR.G2.D0_P: J2.85
IL0.LR.G2.D1_N: J2.82
IL0.LR.G2.D1_P: J2.83
IL0.LR.G2.D2_N: J2.93
IL0.LR.G2.D2_P: J2.92
IL0.LR.G2.D3_N: J2.89
IL0.LR.G2.D3_P: J2.88
IL0.LR.G2.D4_N: J2.96
IL0.LR.G2.D4_P: J2.95
IL0.LR.G2.S_N: J2.99
IL0.LR.G2.S_P: J2.98
IL0.LR.G3.D0_N: J2.105
IL0.LR.G3.D0_P: J2.106
IL0.LR.G3.D1_N: J2.116
IL0.LR.G3.D1_P: J2.115
IL0.LR.G3.D2_N: J2.109
IL0.LR.G3.D2_P: J2.108
IL0.LR.G3.D3_N: J2.113
IL0.LR.G3.D3_P: J2.112
IL0.LR.G3.D4_N: J2.103
IL0.LR.G3.D4_P: J2.102
IL0.LR.G3.S_N: J2.119
IL0.LR.G3.S_P: J2.118
IL0.LR.VTT: J2.162 J2.163 J2.165 J2.166 J2.168 J2.169 J2.172 J2.173 R21.2  [also labelled IL1.LR.VTT, VTTREF_L_B]
IL0.TB.G8.D0_N: J2.36
IL0.TB.G8.D0_P: J2.35
IL0.TB.G8.D1_N: J2.26
IL0.TB.G8.D1_P: J2.25
IL0.TB.G8.D2_N: J2.32
IL0.TB.G8.D2_P: J2.33
IL0.TB.G8.D3_N: J2.28
IL0.TB.G8.D3_P: J2.29
IL0.TB.G13.C_N: J2.2
IL0.TB.G13.C_P: J2.3
IL0.TB.G13.D0_N: J2.12
IL0.TB.G13.D0_P: J2.13
IL0.TB.G13.D1_N: J2.9
IL0.TB.G13.D1_P: J2.8
IL0.TB.G13.D2_N: J2.15
IL0.TB.G13.D2_P: J2.16
IL0.TB.G13.D3_N: J2.22
IL0.TB.G13.D3_P: J2.23
IL0.TB.G13.D4_N: J2.19
IL0.TB.G13.D4_P: J2.18
IL0.TB.G13.D5_N: J2.5
IL0.TB.G13.D5_P: J2.6
IL0.TB.G13.D6: J2.38
IL0.VIOLR: J2.175 J2.176 J2.178 J2.179 J2.182 J2.183 J2.185 J2.186 J2.188 J2.189 J2.192 J2.193 J2.195 J2.196 J2.198 J2.199 R22.2 R23.2 R24.2  [also labelled IL0.VIOTB, IL1.VIOLR, IL1.VIOTB, VIOREF_L_B]
IL1.LR.G0.D0_N: J2.205
IL1.LR.G0.D0_P: J2.206
IL1.LR.G0.D1_N: J2.208
IL1.LR.G0.D1_P: J2.209
IL1.LR.G0.D2_N: J2.202
IL1.LR.G0.D2_P: J2.203
IL1.LR.G0.D3_N: J2.212
IL1.LR.G0.D3_P: J2.213
IL1.LR.G0.D4_N: J2.216
IL1.LR.G0.D4_P: J2.215
IL1.LR.G0.S_N: J2.218
IL1.LR.G0.S_P: J2.219
IL1.LR.G1.D0_N: J2.229
IL1.LR.G1.D0_P: J2.228
IL1.LR.G1.D1_N: J2.222
IL1.LR.G1.D1_P: J2.223
IL1.LR.G1.D2_N: J2.232
IL1.LR.G1.D2_P: J2.233
IL1.LR.G1.D3_N: J2.225
IL1.LR.G1.D3_P: J2.226
IL1.LR.G1.D4_N: J2.235
IL1.LR.G1.D4_P: J2.236
IL1.LR.G1.S_N: J2.239
IL1.LR.G1.S_P: J2.238
IL1.LR.G2.D0_N: J2.242
IL1.LR.G2.D0_P: J2.243
IL1.LR.G2.D1_N: J2.253
IL1.LR.G2.D1_P: J2.252
IL1.LR.G2.D2_N: J2.249
IL1.LR.G2.D2_P: J2.248
IL1.LR.G2.D3_N: J2.246
IL1.LR.G2.D3_P: J2.245
IL1.LR.G2.D4_N: J2.256
IL1.LR.G2.D4_P: J2.255
IL1.LR.G2.S_N: J2.259
IL1.LR.G2.S_P: J2.258
IL1.LR.G3.D0_N: J2.276
IL1.LR.G3.D0_P: J2.275
IL1.LR.G3.D1_N: J2.268
IL1.LR.G3.D1_P: J2.269
IL1.LR.G3.D2_N: J2.273
IL1.LR.G3.D2_P: J2.272
IL1.LR.G3.D3_N: J2.262
IL1.LR.G3.D3_P: J2.263
IL1.LR.G3.D4_N: J2.266
IL1.LR.G3.D4_P: J2.265
IL1.LR.G3.S_N: J2.279
IL1.LR.G3.S_P: J2.278
IL1.TB.G8.D0_N: J2.308
IL1.TB.G8.D0_P: J2.309
IL1.TB.G8.D1_N: J2.315
IL1.TB.G8.D1_P: J2.316
IL1.TB.G8.D2_N: J2.305
IL1.TB.G8.D2_P: J2.306
IL1.TB.G8.D3_N: J2.303
IL1.TB.G8.D3_P: J2.302
IL1.TB.G13.C_N: J2.283
IL1.TB.G13.C_P: J2.282
IL1.TB.G13.D0_N: J2.288
IL1.TB.G13.D0_P: J2.289
IL1.TB.G13.D1_N: J2.299
IL1.TB.G13.D1_P: J2.298
IL1.TB.G13.D2_N: J2.312
IL1.TB.G13.D2_P: J2.313
IL1.TB.G13.D3_N: J2.296
IL1.TB.G13.D3_P: J2.295
IL1.TB.G13.D4_N: J2.292
IL1.TB.G13.D4_P: J2.293
IL1.TB.G13.D5_N: J2.286
IL1.TB.G13.D5_P: J2.285
IL1.TB.G13.D6: J2.318

Not connected (* = marked no-connect by the designer): J2 39* 122* 123* 125* 126* 128* 129* 132* 133* 135* 136* 138* 139* 142* 143* 145* 146* 148* 149* 152* 153* 155* 156* 158* 159* 319* 322* 323* 325* 326* 328* 329* 332* 333* 335* 336* 338* 339* 342* 343* 345* 346* 348* 349* 352* 353* 355* 356* 358* 359* 362* 363* 365* 366* 368* 369* 372* 373* 375* 376* 378* 379* 382* 383* 385* 386* 388* 389* 392* 393* 395* 396* 398* 399*

### Buses and harness runs
harness IL0 = port IL0
harness IL1 = port IL1

### Layout directives
net class z50; differential pair; net class loose: IL0.LR.G0.D0_N, IL0.LR.G0.D0_P, IL0.LR.G0.D1_N, IL0.LR.G0.D1_P, IL0.LR.G0.D2_N, IL0.LR.G0.D2_P, IL0.LR.G0.D3_N, IL0.LR.G0.D3_P, IL0.LR.G0.D4_N, IL0.LR.G0.D4_P, IL0.LR.G0.S_N, IL0.LR.G0.S_P, IL0.LR.G1.D0_N, IL0.LR.G1.D0_P, IL0.LR.G1.D1_N, IL0.LR.G1.D1_P, IL0.LR.G1.D2_N, IL0.LR.G1.D2_P, IL0.LR.G1.D3_N, IL0.LR.G1.D3_P, IL0.LR.G1.D4_N, IL0.LR.G1.D4_P, IL0.LR.G1.S_N, IL0.LR.G1.S_P, IL0.LR.G2.D0_N, IL0.LR.G2.D0_P, IL0.LR.G2.D1_N, IL0.LR.G2.D1_P, IL0.LR.G2.D2_N, IL0.LR.G2.D2_P, IL0.LR.G2.D3_N, IL0.LR.G2.D3_P, IL0.LR.G2.D4_N, IL0.LR.G2.D4_P, IL0.LR.G2.S_N, IL0.LR.G2.S_P, IL0.LR.G3.D0_N, IL0.LR.G3.D0_P, IL0.LR.G3.D1_N, IL0.LR.G3.D1_P, IL0.LR.G3.D2_N, IL0.LR.G3.D2_P, IL0.LR.G3.D3_N, IL0.LR.G3.D3_P, IL0.LR.G3.D4_N, IL0.LR.G3.D4_P, IL0.LR.G3.S_N, IL0.LR.G3.S_P, IL0.TB.G8.D0_N, IL0.TB.G8.D0_P, IL0.TB.G8.D1_N, IL0.TB.G8.D1_P, IL0.TB.G8.D2_N, IL0.TB.G8.D2_P, IL0.TB.G8.D3_N, IL0.TB.G8.D3_P, IL0.TB.G13.C_N, IL0.TB.G13.C_P, IL0.TB.G13.D0_N, IL0.TB.G13.D0_P, IL0.TB.G13.D1_N, IL0.TB.G13.D1_P, IL0.TB.G13.D2_N, IL0.TB.G13.D2_P, IL0.TB.G13.D3_N, IL0.TB.G13.D3_P, IL0.TB.G13.D4_N, IL0.TB.G13.D4_P, IL0.TB.G13.D5_N, IL0.TB.G13.D5_P, IL1.LR.G0.D0_N, IL1.LR.G0.D0_P, IL1.LR.G0.D1_N, IL1.LR.G0.D1_P, IL1.LR.G0.D2_N, IL1.LR.G0.D2_P, IL1.LR.G0.D3_N, IL1.LR.G0.D3_P, IL1.LR.G0.D4_N, IL1.LR.G0.D4_P, IL1.LR.G0.S_N, IL1.LR.G0.S_P, IL1.LR.G1.D0_N, IL1.LR.G1.D0_P, IL1.LR.G1.D1_N, IL1.LR.G1.D1_P, IL1.LR.G1.D2_N, IL1.LR.G1.D2_P, IL1.LR.G1.D3_N, IL1.LR.G1.D3_P, IL1.LR.G1.D4_N, IL1.LR.G1.D4_P, IL1.LR.G1.S_N, IL1.LR.G1.S_P, IL1.LR.G2.D0_N, IL1.LR.G2.D0_P, IL1.LR.G2.D1_N, IL1.LR.G2.D1_P, IL1.LR.G2.D2_N, IL1.LR.G2.D2_P, IL1.LR.G2.D3_N, IL1.LR.G2.D3_P, IL1.LR.G2.D4_N, IL1.LR.G2.D4_P, IL1.LR.G2.S_N, IL1.LR.G2.S_P, IL1.LR.G3.D0_N, IL1.LR.G3.D0_P, IL1.LR.G3.D1_N, IL1.LR.G3.D1_P, IL1.LR.G3.D2_N, IL1.LR.G3.D2_P, IL1.LR.G3.D3_N, IL1.LR.G3.D3_P, IL1.LR.G3.D4_N, IL1.LR.G3.D4_P, IL1.LR.G3.S_N, IL1.LR.G3.S_P, IL1.TB.G8.D0_N, IL1.TB.G8.D0_P, IL1.TB.G8.D1_N, IL1.TB.G8.D1_P, IL1.TB.G8.D2_N, IL1.TB.G8.D2_P, IL1.TB.G8.D3_N, IL1.TB.G8.D3_P, IL1.TB.G13.C_N, IL1.TB.G13.C_P, IL1.TB.G13.D0_N, IL1.TB.G13.D0_P, IL1.TB.G13.D1_N, IL1.TB.G13.D1_P, IL1.TB.G13.D2_N, IL1.TB.G13.D2_P, IL1.TB.G13.D3_N, IL1.TB.G13.D3_P, IL1.TB.G13.D4_N, IL1.TB.G13.D4_P, IL1.TB.G13.D5_N, IL1.TB.G13.D5_P
net class z50: IL0.TB.G13.D6, IL1.TB.G13.D6

### Notes on the sheet
- (near J2) OK
- Referenced Input Reference Voltage
- Title
- Engineer
- Revision
- Drawn By
- Checked By
- Date
- Sheet
- of

### Library data of the parts
J2 = SEAF-40-06.5-S-10-2-A-K-TR: as J1 on sheet con-right-bot; Manufacturer P/N: SEAF-40-06.5-S-10-2-A-K-TR
R21-R24 = RES: Solder Link; Manufacturer P/N: *; Manufacturer: *

## Sheet con-right-top.SchDoc: CS - Right Top
size Letter; CheckedBy: J. Brinton; CompanyName: Signal Laboratories, Inc.; DrawnBy: J. Brinton; Engineer: J. Brinton; Address1: 3479 Edison Way; Address2: Menlo Park CA 94025; Address3: +1 (877) 778-8435; Address4: siglabs.com; Revision: 3; SheetNumber: 34; SheetTotal: 47
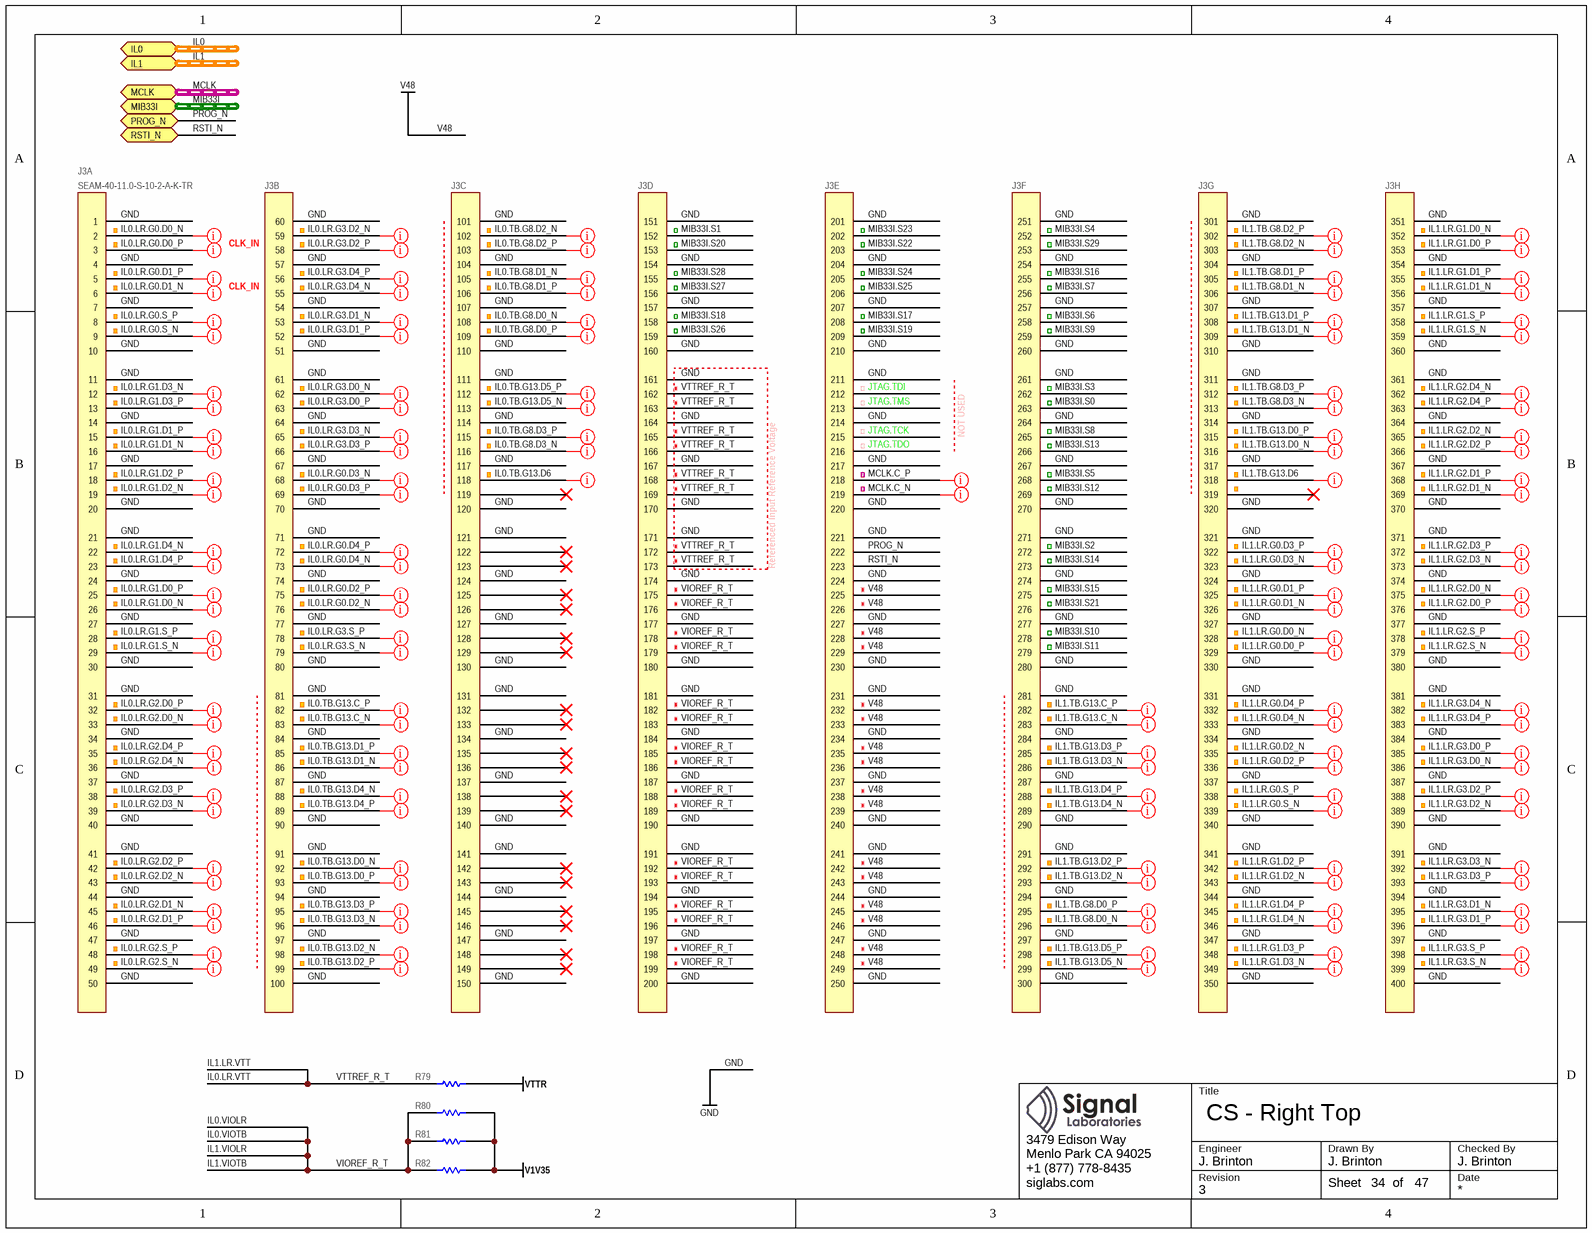
[diagram p17: con-right-top.SchDoc]

### Parts
J3  SEAM-40-11.0-S-10-2-A-K-TR  [SEAM-40-11.0-S-10-2-A-K-TR]  (parts A,B,C,D,E,F,G,H of 8)
R79  SOLDER_LINK  [SOLDERLINK0603X26N]  (value not drawn)  (no BOM)
R80  SOLDER_LINK  [SOLDERLINK0603X26N]  (value not drawn)  (no BOM)
R81  SOLDER_LINK  [SOLDERLINK0603X26N]  (value not drawn)  (no BOM)
R82  SOLDER_LINK  [SOLDERLINK0603X26N]  (value not drawn)  (no BOM)

### Ports
IL0 (harness IL), IL1 (harness IL), MCLK (harness LVPECL33), MIB33I (harness MIB), PROG_N (bidir), RSTI_N (bidir)

### Nets
GND: J3.1 J3.4 J3.7 J3.10 J3.11 J3.14 J3.17 J3.20 J3.21 J3.24 J3.27 J3.30 J3.31 J3.34 J3.37 J3.40 J3.41 J3.44 J3.47 J3.50 J3.51 J3.54 J3.57 J3.60 J3.61 J3.64 J3.67 J3.70 J3.71 J3.74 J3.77 J3.80 J3.81 J3.84 J3.87 J3.90 J3.91 J3.94 J3.97 J3.100 J3.101 J3.104 J3.107 J3.110 J3.111 J3.114 J3.117 J3.120 J3.121 J3.124 J3.127 J3.130 J3.131 J3.134 J3.137 J3.140 J3.141 J3.144 J3.147 J3.150 J3.151 J3.154 J3.157 J3.160 J3.161 J3.164 J3.167 J3.170 J3.171 J3.174 J3.177 J3.180 J3.181 J3.184 J3.187 J3.190 J3.191 J3.194 J3.197 J3.200 J3.201 J3.204 J3.207 J3.210 J3.211 J3.214 J3.217 J3.220 J3.221 J3.224 J3.227 J3.230 J3.231 J3.234 J3.237 J3.240 J3.241 J3.244 J3.247 J3.250 J3.251 J3.254 J3.257 J3.260 J3.261 J3.264 J3.267 J3.270 J3.271 J3.274 J3.277 J3.280 J3.281 J3.284 J3.287 J3.290 J3.291 J3.294 J3.297 J3.300 J3.301 J3.304 J3.307 J3.310 J3.311 J3.314 J3.317 J3.320 J3.321 J3.324 J3.327 J3.330 J3.331 J3.334 J3.337 J3.340 J3.341 J3.344 J3.347 J3.350 J3.351 J3.354 J3.357 J3.360 J3.361 J3.364 J3.367 J3.370 J3.371 J3.374 J3.377 J3.380 J3.381 J3.384 J3.387 J3.390 J3.391 J3.394 J3.397 J3.400
V1V35: R80.1 R81.1 R82.1
V48: J3.225 J3.226 J3.228 J3.229 J3.232 J3.233 J3.235 J3.236 J3.238 J3.239 J3.242 J3.243 J3.245 J3.246 J3.248 J3.249
VTTR: R79.1
IL0.LR.G0.D0_N: J3.2
IL0.LR.G0.D0_P: J3.3
IL0.LR.G0.D1_N: J3.6
IL0.LR.G0.D1_P: J3.5
IL0.LR.G0.D2_N: J3.76
IL0.LR.G0.D2_P: J3.75
IL0.LR.G0.D3_N: J3.68
IL0.LR.G0.D3_P: J3.69
IL0.LR.G0.D4_N: J3.73
IL0.LR.G0.D4_P: J3.72
IL0.LR.G0.S_N: J3.9
IL0.LR.G0.S_P: J3.8
IL0.LR.G1.D0_N: J3.26
IL0.LR.G1.D0_P: J3.25
IL0.LR.G1.D1_N: J3.16
IL0.LR.G1.D1_P: J3.15
IL0.LR.G1.D2_N: J3.19
IL0.LR.G1.D2_P: J3.18
IL0.LR.G1.D3_N: J3.12
IL0.LR.G1.D3_P: J3.13
IL0.LR.G1.D4_N: J3.22
IL0.LR.G1.D4_P: J3.23
IL0.LR.G1.S_N: J3.29
IL0.LR.G1.S_P: J3.28
IL0.LR.G2.D0_N: J3.33
IL0.LR.G2.D0_P: J3.32
IL0.LR.G2.D1_N: J3.45
IL0.LR.G2.D1_P: J3.46
IL0.LR.G2.D2_N: J3.43
IL0.LR.G2.D2_P: J3.42
IL0.LR.G2.D3_N: J3.39
IL0.LR.G2.D3_P: J3.38
IL0.LR.G2.D4_N: J3.36
IL0.LR.G2.D4_P: J3.35
IL0.LR.G2.S_N: J3.49
IL0.LR.G2.S_P: J3.48
IL0.LR.G3.D0_N: J3.62
IL0.LR.G3.D0_P: J3.63
IL0.LR.G3.D1_N: J3.53
IL0.LR.G3.D1_P: J3.52
IL0.LR.G3.D2_N: J3.59
IL0.LR.G3.D2_P: J3.58
IL0.LR.G3.D3_N: J3.65
IL0.LR.G3.D3_P: J3.66
IL0.LR.G3.D4_N: J3.55
IL0.LR.G3.D4_P: J3.56
IL0.LR.G3.S_N: J3.79
IL0.LR.G3.S_P: J3.78
IL0.LR.VTT: J3.162 J3.163 J3.165 J3.166 J3.168 J3.169 J3.172 J3.173 R79.2  [also labelled IL1.LR.VTT, VTTREF_R_T]
IL0.TB.G8.D0_N: J3.108
IL0.TB.G8.D0_P: J3.109
IL0.TB.G8.D1_N: J3.105
IL0.TB.G8.D1_P: J3.106
IL0.TB.G8.D2_N: J3.102
IL0.TB.G8.D2_P: J3.103
IL0.TB.G8.D3_N: J3.116
IL0.TB.G8.D3_P: J3.115
IL0.TB.G13.C_N: J3.83
IL0.TB.G13.C_P: J3.82
IL0.TB.G13.D0_N: J3.92
IL0.TB.G13.D0_P: J3.93
IL0.TB.G13.D1_N: J3.86
IL0.TB.G13.D1_P: J3.85
IL0.TB.G13.D2_N: J3.98
IL0.TB.G13.D2_P: J3.99
IL0.TB.G13.D3_N: J3.96
IL0.TB.G13.D3_P: J3.95
IL0.TB.G13.D4_N: J3.88
IL0.TB.G13.D4_P: J3.89
IL0.TB.G13.D5_N: J3.113
IL0.TB.G13.D5_P: J3.112
IL0.TB.G13.D6: J3.118
IL0.VIOLR: J3.175 J3.176 J3.178 J3.179 J3.182 J3.183 J3.185 J3.186 J3.188 J3.189 J3.192 J3.193 J3.195 J3.196 J3.198 J3.199 R80.2 R81.2 R82.2  [also labelled IL0.VIOTB, IL1.VIOLR, IL1.VIOTB, VIOREF_R_T]
IL1.LR.G0.D0_N: J3.328
IL1.LR.G0.D0_P: J3.329
IL1.LR.G0.D1_N: J3.326
IL1.LR.G0.D1_P: J3.325
IL1.LR.G0.D2_N: J3.335
IL1.LR.G0.D2_P: J3.336
IL1.LR.G0.D3_N: J3.323
IL1.LR.G0.D3_P: J3.322
IL1.LR.G0.D4_N: J3.333
IL1.LR.G0.D4_P: J3.332
IL1.LR.G0.S_N: J3.339
IL1.LR.G0.S_P: J3.338
IL1.LR.G1.D0_N: J3.352
IL1.LR.G1.D0_P: J3.353
IL1.LR.G1.D1_N: J3.356
IL1.LR.G1.D1_P: J3.355
IL1.LR.G1.D2_N: J3.343
IL1.LR.G1.D2_P: J3.342
IL1.LR.G1.D3_N: J3.349
IL1.LR.G1.D3_P: J3.348
IL1.LR.G1.D4_N: J3.346
IL1.LR.G1.D4_P: J3.345
IL1.LR.G1.S_N: J3.359
IL1.LR.G1.S_P: J3.358
IL1.LR.G2.D0_N: J3.375
IL1.LR.G2.D0_P: J3.376
IL1.LR.G2.D1_N: J3.369
IL1.LR.G2.D1_P: J3.368
IL1.LR.G2.D2_N: J3.365
IL1.LR.G2.D2_P: J3.366
IL1.LR.G2.D3_N: J3.373
IL1.LR.G2.D3_P: J3.372
IL1.LR.G2.D4_N: J3.362
IL1.LR.G2.D4_P: J3.363
IL1.LR.G2.S_N: J3.379
IL1.LR.G2.S_P: J3.378
IL1.LR.G3.D0_N: J3.386
IL1.LR.G3.D0_P: J3.385
IL1.LR.G3.D1_N: J3.395
IL1.LR.G3.D1_P: J3.396
IL1.LR.G3.D2_N: J3.389
IL1.LR.G3.D2_P: J3.388
IL1.LR.G3.D3_N: J3.392
IL1.LR.G3.D3_P: J3.393
IL1.LR.G3.D4_N: J3.382
IL1.LR.G3.D4_P: J3.383
IL1.LR.G3.S_N: J3.399
IL1.LR.G3.S_P: J3.398
IL1.TB.G8.D0_N: J3.296
IL1.TB.G8.D0_P: J3.295
IL1.TB.G8.D1_N: J3.306
IL1.TB.G8.D1_P: J3.305
IL1.TB.G8.D2_N: J3.303
IL1.TB.G8.D2_P: J3.302
IL1.TB.G8.D3_N: J3.313
IL1.TB.G8.D3_P: J3.312
IL1.TB.G13.C_N: J3.283
IL1.TB.G13.C_P: J3.282
IL1.TB.G13.D0_N: J3.316
IL1.TB.G13.D0_P: J3.315
IL1.TB.G13.D1_N: J3.309
IL1.TB.G13.D1_P: J3.308
IL1.TB.G13.D2_N: J3.293
IL1.TB.G13.D2_P: J3.292
IL1.TB.G13.D3_N: J3.286
IL1.TB.G13.D3_P: J3.285
IL1.TB.G13.D4_N: J3.289
IL1.TB.G13.D4_P: J3.288
IL1.TB.G13.D5_N: J3.299
IL1.TB.G13.D5_P: J3.298
IL1.TB.G13.D6: J3.318
MCLK.C_N: J3.219
MCLK.C_P: J3.218
MIB33I.S0: J3.263
MIB33I.S1: J3.152
MIB33I.S2: J3.272
MIB33I.S3: J3.262
MIB33I.S4: J3.252
MIB33I.S5: J3.268
MIB33I.S6: J3.258
MIB33I.S7: J3.256
MIB33I.S8: J3.265
MIB33I.S9: J3.259
MIB33I.S10: J3.278
MIB33I.S11: J3.279
MIB33I.S12: J3.269
MIB33I.S13: J3.266
MIB33I.S14: J3.273
MIB33I.S15: J3.275
MIB33I.S16: J3.255
MIB33I.S17: J3.208
MIB33I.S18: J3.158
MIB33I.S19: J3.209
MIB33I.S20: J3.153
MIB33I.S21: J3.276
MIB33I.S22: J3.203
MIB33I.S23: J3.202
MIB33I.S24: J3.205
MIB33I.S25: J3.206
MIB33I.S26: J3.159
MIB33I.S27: J3.156
MIB33I.S28: J3.155
MIB33I.S29: J3.253
PROG_N: J3.222 ; port PROG_N
RSTI_N: J3.223 ; port RSTI_N

Not connected (* = marked no-connect by the designer): J3 119* 122* 123* 125* 126* 128* 129* 132* 133* 135* 136* 138* 139* 142* 143* 145* 146* 148* 149* 212 213 215 216 319*

### Buses and harness runs
harness IL0 = port IL0
harness IL1 = port IL1
harness MCLK = port MCLK
harness MIB33I = port MIB33I

### Layout directives
net class z50: IL0.TB.G13.D6, IL1.TB.G13.D6
net class z50; differential pair; net class loose: IL0.LR.G0.D0_N, IL0.LR.G0.D0_P, IL0.LR.G0.D1_N, IL0.LR.G0.D1_P, IL0.LR.G0.D2_N, IL0.LR.G0.D2_P, IL0.LR.G0.D3_N, IL0.LR.G0.D3_P, IL0.LR.G0.D4_N, IL0.LR.G0.D4_P, IL0.LR.G0.S_N, IL0.LR.G0.S_P, IL0.LR.G1.D0_N, IL0.LR.G1.D0_P, IL0.LR.G1.D1_N, IL0.LR.G1.D1_P, IL0.LR.G1.D2_N, IL0.LR.G1.D2_P, IL0.LR.G1.D3_N, IL0.LR.G1.D3_P, IL0.LR.G1.D4_N, IL0.LR.G1.D4_P, IL0.LR.G1.S_N, IL0.LR.G1.S_P, IL0.LR.G2.D0_N, IL0.LR.G2.D0_P, IL0.LR.G2.D1_N, IL0.LR.G2.D1_P, IL0.LR.G2.D2_N, IL0.LR.G2.D2_P, IL0.LR.G2.D3_N, IL0.LR.G2.D3_P, IL0.LR.G2.D4_N, IL0.LR.G2.D4_P, IL0.LR.G2.S_N, IL0.LR.G2.S_P, IL0.LR.G3.D0_N, IL0.LR.G3.D0_P, IL0.LR.G3.D1_N, IL0.LR.G3.D1_P, IL0.LR.G3.D2_N, IL0.LR.G3.D2_P, IL0.LR.G3.D3_N, IL0.LR.G3.D3_P, IL0.LR.G3.D4_N, IL0.LR.G3.D4_P, IL0.LR.G3.S_N, IL0.LR.G3.S_P, IL0.TB.G8.D0_N, IL0.TB.G8.D0_P, IL0.TB.G8.D1_N, IL0.TB.G8.D1_P, IL0.TB.G8.D2_N, IL0.TB.G8.D2_P, IL0.TB.G8.D3_N, IL0.TB.G8.D3_P, IL0.TB.G13.C_N, IL0.TB.G13.C_P, IL0.TB.G13.D0_N, IL0.TB.G13.D0_P, IL0.TB.G13.D1_N, IL0.TB.G13.D1_P, IL0.TB.G13.D2_N, IL0.TB.G13.D2_P, IL0.TB.G13.D3_N, IL0.TB.G13.D3_P, IL0.TB.G13.D4_N, IL0.TB.G13.D4_P, IL0.TB.G13.D5_N, IL0.TB.G13.D5_P, IL1.LR.G0.D0_N, IL1.LR.G0.D0_P, IL1.LR.G0.D1_N, IL1.LR.G0.D1_P, IL1.LR.G0.D2_N, IL1.LR.G0.D2_P, IL1.LR.G0.D3_N, IL1.LR.G0.D3_P, IL1.LR.G0.D4_N, IL1.LR.G0.D4_P, IL1.LR.G0.S_N, IL1.LR.G0.S_P, IL1.LR.G1.D0_N, IL1.LR.G1.D0_P, IL1.LR.G1.D1_N, IL1.LR.G1.D1_P, IL1.LR.G1.D2_N, IL1.LR.G1.D2_P, IL1.LR.G1.D3_N, IL1.LR.G1.D3_P, IL1.LR.G1.D4_N, IL1.LR.G1.D4_P, IL1.LR.G1.S_N, IL1.LR.G1.S_P, IL1.LR.G2.D0_N, IL1.LR.G2.D0_P, IL1.LR.G2.D1_N, IL1.LR.G2.D1_P, IL1.LR.G2.D2_N, IL1.LR.G2.D2_P, IL1.LR.G2.D3_N, IL1.LR.G2.D3_P, IL1.LR.G2.D4_N, IL1.LR.G2.D4_P, IL1.LR.G2.S_N, IL1.LR.G2.S_P, IL1.LR.G3.D0_N, IL1.LR.G3.D0_P, IL1.LR.G3.D1_N, IL1.LR.G3.D1_P, IL1.LR.G3.D2_N, IL1.LR.G3.D2_P, IL1.LR.G3.D3_N, IL1.LR.G3.D3_P, IL1.LR.G3.D4_N, IL1.LR.G3.D4_P, IL1.LR.G3.S_N, IL1.LR.G3.S_P, IL1.TB.G8.D0_N, IL1.TB.G8.D0_P, IL1.TB.G8.D1_N, IL1.TB.G8.D1_P, IL1.TB.G8.D2_N, IL1.TB.G8.D2_P, IL1.TB.G8.D3_N, IL1.TB.G8.D3_P, IL1.TB.G13.C_N, IL1.TB.G13.C_P, IL1.TB.G13.D0_N, IL1.TB.G13.D0_P, IL1.TB.G13.D1_N, IL1.TB.G13.D1_P, IL1.TB.G13.D2_N, IL1.TB.G13.D2_P, IL1.TB.G13.D3_N, IL1.TB.G13.D3_P, IL1.TB.G13.D4_N, IL1.TB.G13.D4_P, IL1.TB.G13.D5_N, IL1.TB.G13.D5_P
net class z50; differential pair; net class tight: MCLK.C_N, MCLK.C_P

### Notes on the sheet
- (near J3) CLK_IN
- (near J3) JTAG.TDI
- (near J3) JTAG.TCK
- (near J3) JTAG.TDO
- (near J3) JTAG.TMS
- NOT USED
- Referenced Input Reference Voltage
- Title
- Engineer
- Revision
- Drawn By
- Checked By
- Date
- Sheet
- of

### Library data of the parts
J3 = SEAM-40-11.0-S-10-2-A-K-TR: Terminal Array Assembly, Surface Mount, 0.050" Pitch, 400 Pins; Manufacturer: Samtec; Manufacturer P/N: SEAM-40-11.0-S-10-2-A-K-TR
R79-R82 = RES: Solder Link; Manufacturer P/N: *; Manufacturer: *